# EAGLE design teletype-180824-no-slots (EAGLE 9.1.0)
COMPANY: monome

## Sheet 1 of 2
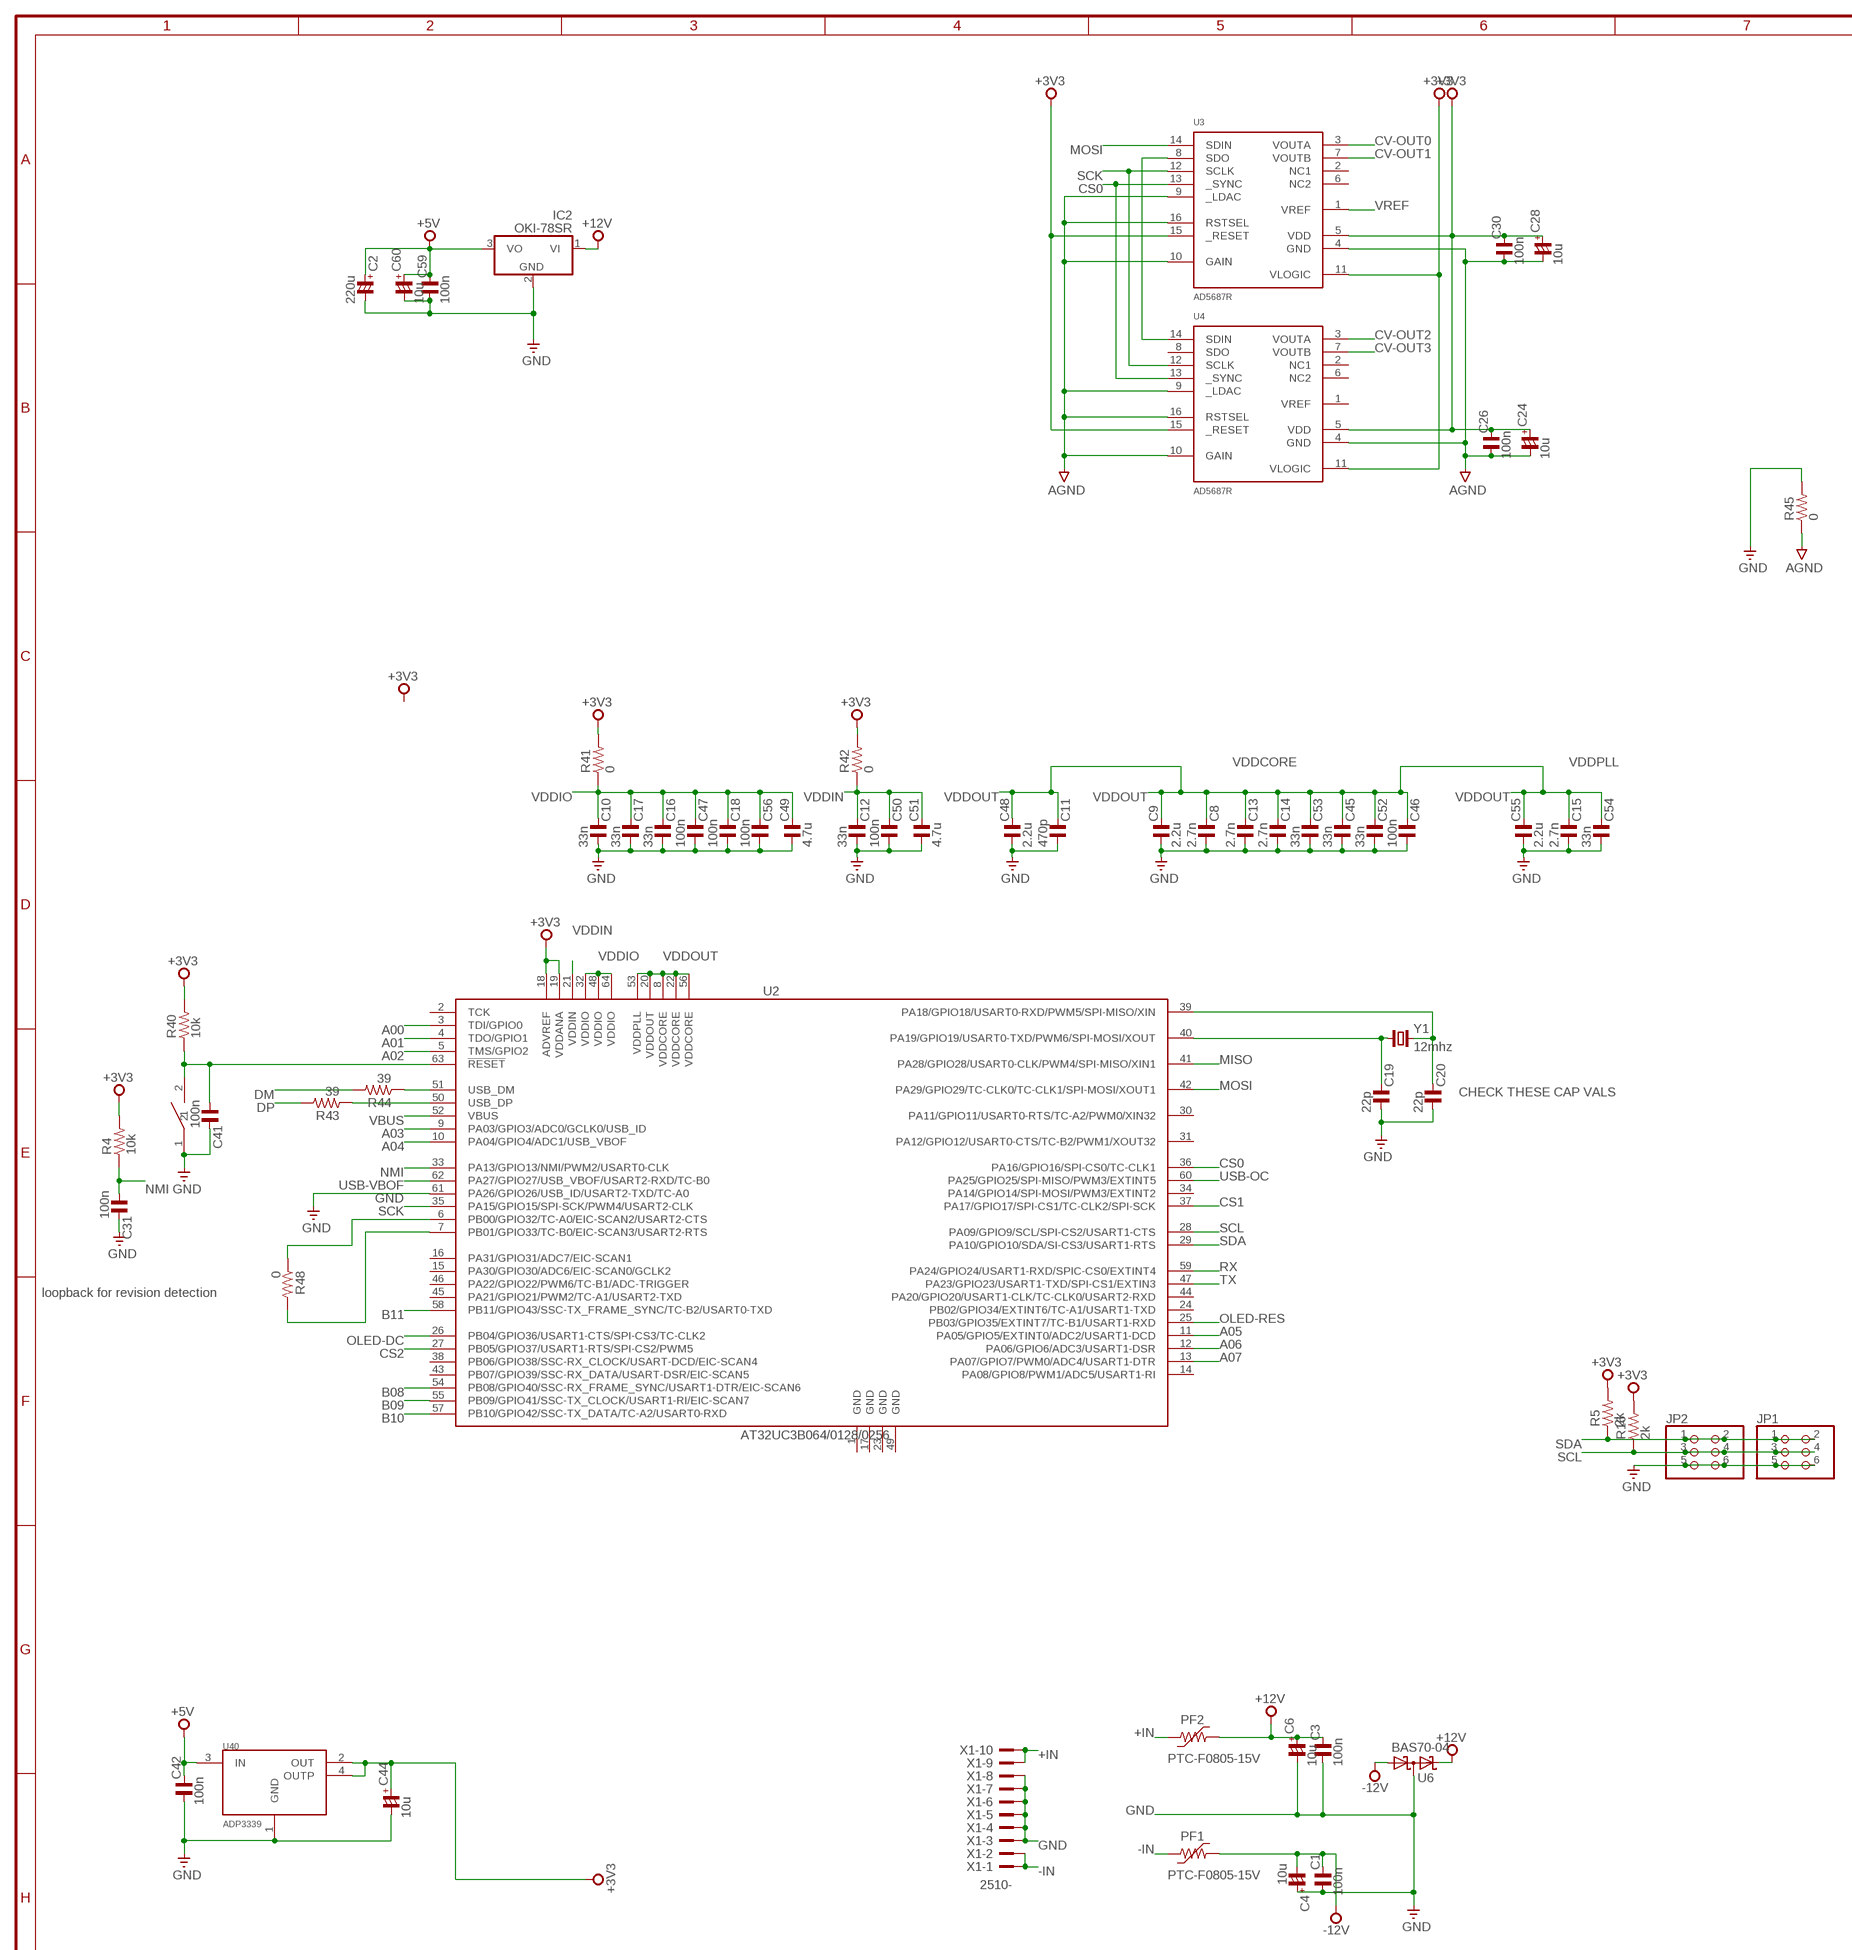
[diagram p0: schematic, sheet 1, part 1 of 2]
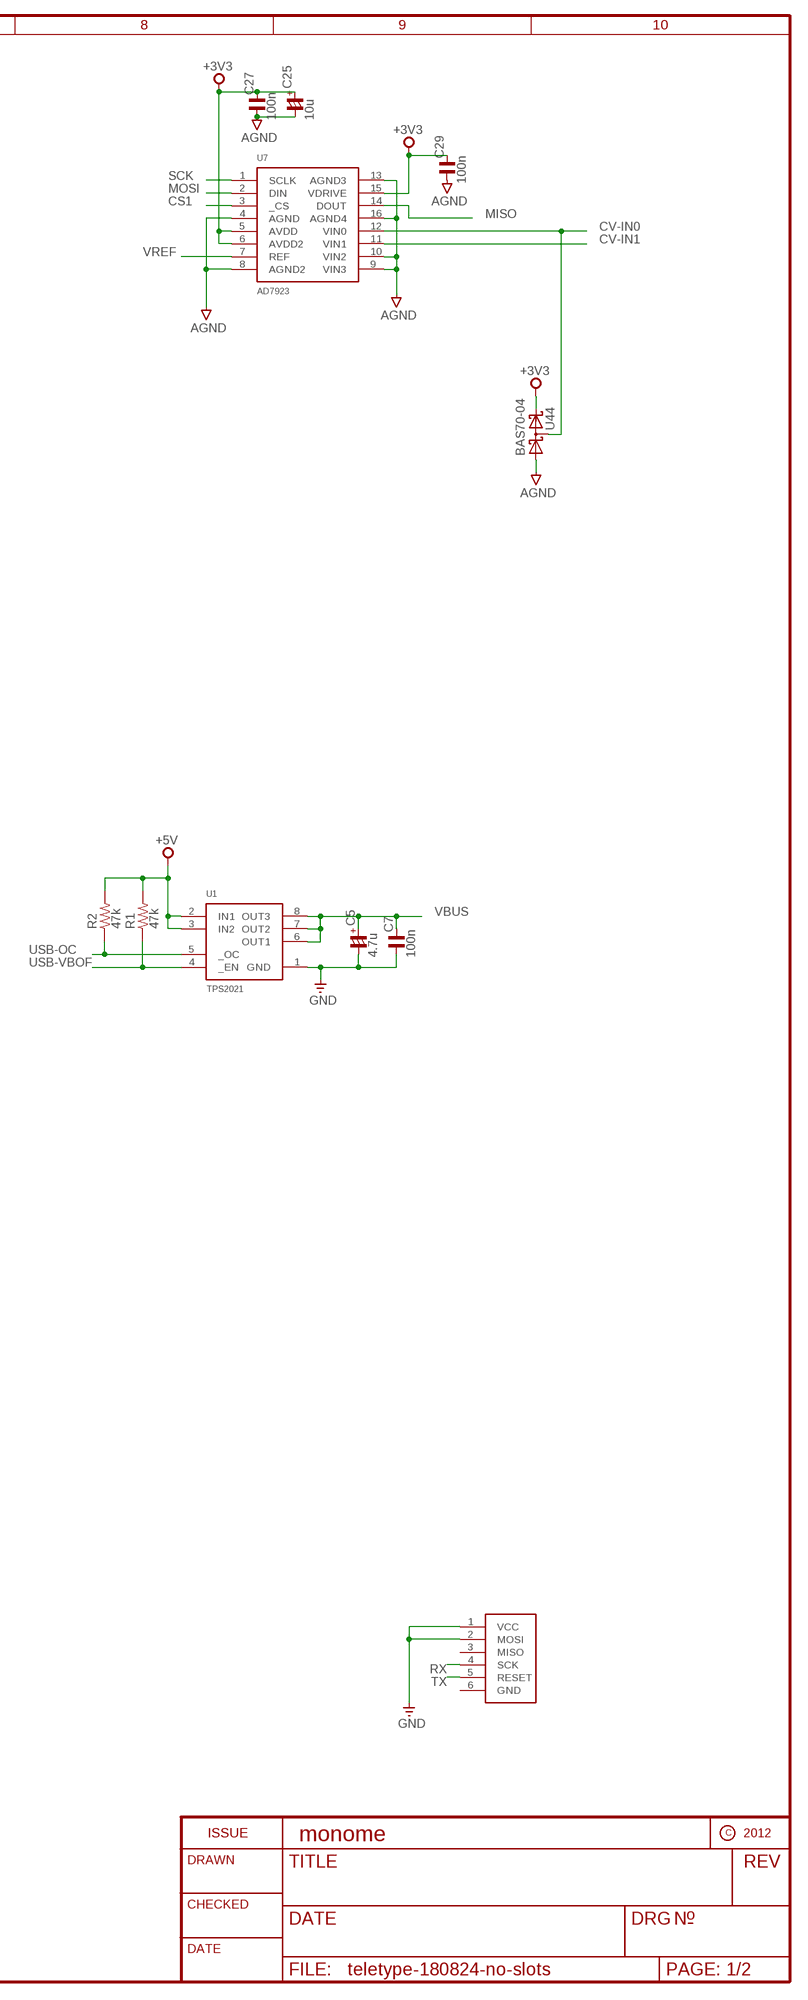
[diagram p1: schematic, sheet 1, part 2 of 2]

### Parts
C1  100n  C_0402  [C0402]
C2  220u  CP_7343-43  [C7343-43]
C3  100n  C_0402  [C0402]
C4  10u  CP_1206/T  [C1206/T]
C5  4.7u  CP_1206/T  [C1206/T]
C6  10u  CP_1206/T  [C1206/T]
C7  100n  C_0402  [C0402]
C8  2.7n  C_0402  [C0402]
C9  2.2u  C_0603  [C0603]
C10  33n  C_0402  [C0402]
C11  470p  C_0402  [C0402]
C12  33n  C_0402  [C0402]
C13  2.7n  C_0402  [C0402]
C14  2.7n  C_0402  [C0402]
C15  2.7n  C_0402  [C0402]
C16  33n  C_0402  [C0402]
C17  33n  C_0402  [C0402]
C18  100n  C_0402  [C0402]
C19  22p  C_0402  [C0402]
C20  22p  C_0402  [C0402]
C24  10u  CP_1206/T  [C1206/T]
C25  10u  CP_1206/T  [C1206/T]
C26  100n  C_0402  [C0402]
C27  100n  C_0402  [C0402]
C28  10u  CP_1206/T  [C1206/T]
C29  100n  C_0402  [C0402]
C30  100n  C_0402  [C0402]
C31  100n  C_0402  [C0402]
C41  100n  C_0402  [C0402]
C42  100n  C_0402  [C0402]
C44  10u  CP_1206/T  [C1206/T]
C45  33n  C_0402  [C0402]
C46  100n  C_0402  [C0402]
C47  100n  C_0402  [C0402]
C48  2.2u  C_0603  [C0603]
C49  4.7u  C_0603  [C0603]
C50  100n  C_0402  [C0402]
C51  4.7u  C_0603  [C0603]
C52  33n  C_0402  [C0402]
C53  33n  C_0402  [C0402]
C54  33n  C_0402  [C0402]
C55  2.2u  C_0603  [C0603]
C56  100n  C_0402  [C0402]
C59  100n  C_0402  [C0402]
C60  10u  CP_1206/T  [C1206/T]
IC2  OKI-78SR  7824TV  [TO220V]
J40  ISP-ROW  [ISP-ROW]
JP1  PINHD-2X3  [2X03]
JP2  PINHD-2X3  [2X03]
PF1  PTC-F0805-15V  PTC-F1206  [F1206]
PF2  PTC-F0805-15V  PTC-F1206  [F1206]
R1  47k  R_0402  [R0402]
R2  47k  R_0402  [R0402]
R4  10k  R_0402  [R0402]
R5  2k  R_0402  [R0402]
R16  2k  R_0402  [R0402]
R40  10k  R_0402  [R0402]
R41  0  R_0402  [R0402]
R42  0  R_0402  [R0402]
R43  39  R_0402  [R0402]
R44  39  R_0402  [R0402]
R45  0  R_0603  [R0603]
R48  0  R_0402  [R0402]
SW40  PANASONIC-EVQ  [PANASONIC-EVQ]
U1  TPS2021  TPS2020  [SO08]
U2  AT32UC3B064/0128/0256  [TQFP64-10X10]
U3  AD5687R  AD5689R  [TSSOP16]
U4  AD5687R  AD5689R  [TSSOP16]
U6  BAS70-04  [SOT23]
U7  AD7923  [TSSOP16]
U40  ADP3339  [SOT223]
U44  BAS70-04  [SOT23]
X1  2510-  [PAK100/2500-10]
Y1  12mhz  CRYTALHC49UP  [HC49UP]

### Nets
+3V3: C24.+ C25.+ C26.2 C27.2 C28.+ C29.2 C30.2 C44.+ R4.2 R5.2 R16.2 R40.2 R41.2 R42.2 U2.18(ADVREF) U2.19(VDDANA) U3.5(VDD) U3.11(VLOGIC) U3.15(_RESET) U4.5(VDD) U4.11(VLOGIC) U4.15(_RESET) U7.5(AVDD) U7.6(AVDD2) U7.15(VDRIVE) U40.2(OUT) U40.4(OUTP) U44.2(C2) ; also sheet 2
+5V: C2.+ C42.2 C59.2 C60.+ IC2.3(VO) R1.2 R2.2 U1.2(IN1) U1.3(IN2) U40.3(IN)
+12V: C3.2 C6.+ IC2.1(VI) PF2.2 U6.2(C2) ; also sheet 2
+IN: PF2.1 X1.9 X1.10
-12V: C1.2 C4.- PF1.2 U6.1(A1) ; also sheet 2
-IN: PF1.1 X1.1 X1.2
A00: U2.3(TDI/GPIO0) ; also sheet 2
A01: U2.4(TDO/GPIO1) ; also sheet 2
A02: U2.5(TMS/GPIO2) ; also sheet 2
A03: U2.9(PA03/GPIO3/ADC0/GCLK0/USB_ID) ; also sheet 2
A04: U2.10(PA04/GPIO4/ADC1/USB_VBOF) ; also sheet 2
A05: U2.11(PA05/GPIO5/EXTINT0/ADC2/USART1-DCD) ; also sheet 2
A06: U2.12(PA06/GPIO6/ADC3/USART1-DSR) ; also sheet 2
A07: U2.13(PA07/GPIO7/PWM0/ADC4/USART1-DTR) ; also sheet 2
AGND: C24.- C25.- C26.1 C27.1 C28.- C29.1 C30.1 R45.1 U3.4(GND) U3.9(_LDAC) U3.10(GAIN) U3.16(RSTSEL) U4.4(GND) U4.9(_LDAC) U4.10(GAIN) U4.16(RSTSEL) U7.4(AGND) U7.8(AGND2) U7.9(VIN3) U7.10(VIN2) U7.13(AGND3) U7.16(AGND4) U44.1(A1) ; also sheet 2
B08: U2.54(PB08/GPIO40/SSC-RX_FRAME_SYNC/USART1-DTR/EIC-SCAN6) ; also sheet 2
B09: U2.55(PB09/GPIO41/SSC-TX_CLOCK/USART1-RI/EIC-SCAN7) ; also sheet 2
B10: U2.57(PB10/GPIO42/SSC-TX_DATA/TC-A2/USART0-RXD) ; also sheet 2
B11: U2.58(PB11/GPIO43/SSC-TX_FRAME_SYNC/TC-B2/USART0-TXD) ; also sheet 2
CS0: U2.36(PA16/GPIO16/SPI-CS0/TC-CLK1) U3.13(_SYNC) U4.13(_SYNC)
CS1: U2.37(PA17/GPIO17/SPI-CS1/TC-CLK2/SPI-SCK) U7.3(_CS)
CS2: U2.27(PB05/GPIO37/USART1-RTS/SPI-CS2/PWM5) ; also sheet 2
CV-IN0: U7.12(VIN0) U44.3(C1A2) ; also sheet 2
CV-IN1: U7.11(VIN1) ; also sheet 2
CV-OUT0: U3.3(VOUTA) ; also sheet 2
CV-OUT1: U3.7(VOUTB) ; also sheet 2
CV-OUT2: U4.3(VOUTA) ; also sheet 2
CV-OUT3: U4.7(VOUTB) ; also sheet 2
DM: R44.2 ; also sheet 2
DP: R43.2 ; also sheet 2
GND: C1.1 C2.- C3.1 C4.+ C5.- C6.- C7.1 C8.1 C9.1 C10.1 C11.1 C12.1 C13.1 C14.1 C15.1 C16.1 C17.1 C18.1 C19.1 C20.1 C31.2 C41.2 C42.1 C44.- C45.1 C46.1 C47.1 C48.1 C49.1 C50.1 C51.1 C52.1 C53.1 C54.1 C55.1 C56.1 C59.1 C60.- IC2.2(GND) J40.1(VCC) J40.2(MOSI) JP1.5 JP1.6 JP2.5 JP2.6 R45.2 SW40.1 U1.1(GND) U2.61(PA26/GPIO26/USB_ID/USART2-TXD/TC-A0) U6.3(C1A2) U40.1(GND) X1.3 X1.4 X1.5 X1.6 X1.7 X1.8 ; also sheet 2
MISO: U2.41(PA28/GPIO28/USART0-CLK/PWM4/SPI-MISO/XIN1) U7.14(DOUT)
MOSI: U2.42(PA29/GPIO29/TC-CLK0/TC-CLK1/SPI-MOSI/XOUT1) U3.14(SDIN) U7.2(DIN) ; also sheet 2
N$1: R44.1 U2.51(USB_DM)
N$2: R43.1 U2.50(USB_DP)
N$4: U3.8(SDO) U4.14(SDIN)
N$14: C20.2 U2.39(PA18/GPIO18/USART0-RXD/PWM5/SPI-MISO/XIN) Y1.2
N$17: R48.1 U2.6(PB00/GPIO32/TC-A0/EIC-SCAN2/USART2-CTS)
N$18: R48.2 U2.7(PB01/GPIO33/TC-B0/EIC-SCAN3/USART2-RTS)
N$109: C19.2 U2.40(PA19/GPIO19/USART0-TXD/PWM6/SPI-MOSI/XOUT) Y1.1
NMI: C31.1 R4.1 U2.33(PA13/GPIO13/NMI/PWM2/USART0-CLK) ; also sheet 2
OLED-DC: U2.26(PB04/GPIO36/USART1-CTS/SPI-CS3/TC-CLK2) ; also sheet 2
OLED-RES: U2.25(PB03/GPIO35/EXTINT7/TC-B1/USART1-RXD) ; also sheet 2
RESET: C41.1 R40.1 SW40.2 U2.63(!RESET)
RX: J40.4(SCK) U2.59(PA24/GPIO24/USART1-RXD/SPIC-CS0/EXTINT4)
SCK: U2.35(PA15/GPIO15/SPI-SCK/PWM4/USART2-CLK) U3.12(SCLK) U4.12(SCLK) U7.1(SCLK) ; also sheet 2
SCL: JP1.3 JP1.4 JP2.3 JP2.4 R16.1 U2.28(PA09/GPIO9/SCL/SPI-CS2/USART1-CTS)
SDA: JP1.1 JP1.2 JP2.1 JP2.2 R5.1 U2.29(PA10/GPIO10/SDA/SI-CS3/USART1-RTS)
TX: J40.5(RESET) U2.47(PA23/GPIO23/USART1-TXD/SPI-CS1/EXTIN3)
USB-OC: R2.1 U1.5(_OC) U2.60(PA25/GPIO25/SPI-MISO/PWM3/EXTINT5)
USB-VBOF: R1.1 U1.4(_EN) U2.62(PA27/GPIO27/USB_VBOF/USART2-RXD/TC-B0)
VBUS: C5.+ C7.2 U1.6(OUT1) U1.7(OUT2) U1.8(OUT3) U2.52(VBUS) ; also sheet 2
VDDIN: C12.2 C50.2 C51.2 R42.1 U2.21(VDDIN)
VDDIO: C10.2 C16.2 C17.2 C18.2 C47.2 C49.2 C56.2 R41.1 U2.32(VDDIO) U2.48(VDDIO) U2.64(VDDIO)
VDDOUT: C8.2 C9.2 C11.2 C13.2 C14.2 C15.2 C45.2 C46.2 C48.2 C52.2 C53.2 C54.2 C55.2 U2.8(VDDCORE) U2.20(VDDOUT) U2.22(VDDCORE) U2.53(VDDPLL) U2.56(VDDCORE)
VREF: U3.1(VREF) U7.7(REF)
Unconnected: J40.3(MISO) J40.6(GND) U2.2(TCK) U2.14(PA08/GPIO8/PWM1/ADC5/USART1-RI) U2.15(PA30/GPIO30/ADC6/EIC-SCAN0/GCLK2) U2.16(PA31/GPIO31/ADC7/EIC-SCAN1) U2.24(PB02/GPIO34/EXTINT6/TC-A1/USART1-TXD) U2.30(PA11/GPIO11/USART0-RTS/TC-A2/PWM0/XIN32) U2.31(PA12/GPIO12/USART0-CTS/TC-B2/PWM1/XOUT32) U2.34(PA14/GPIO14/SPI-MOSI/PWM3/EXTINT2) U2.38(PB06/GPIO38/SSC-RX_CLOCK/USART-DCD/EIC-SCAN4) U2.43(PB07/GPIO39/SSC-RX_DATA/USART-DSR/EIC-SCAN5) U2.44(PA20/GPIO20/USART1-CLK/TC-CLK0/USART2-RXD) U2.45(PA21/GPIO21/PWM2/TC-A1/USART2-TXD) U2.46(PA22/GPIO22/PWM6/TC-B1/ADC-TRIGGER) U3.2(NC1) U3.6(NC2) U4.1(VREF) U4.2(NC1) U4.6(NC2) U4.8(SDO)

### Notes on the sheet
- VDDCORE | VDDPLL
- CHECK THESE CAP VALS
- loopback for revision detection

## Sheet 2 of 2
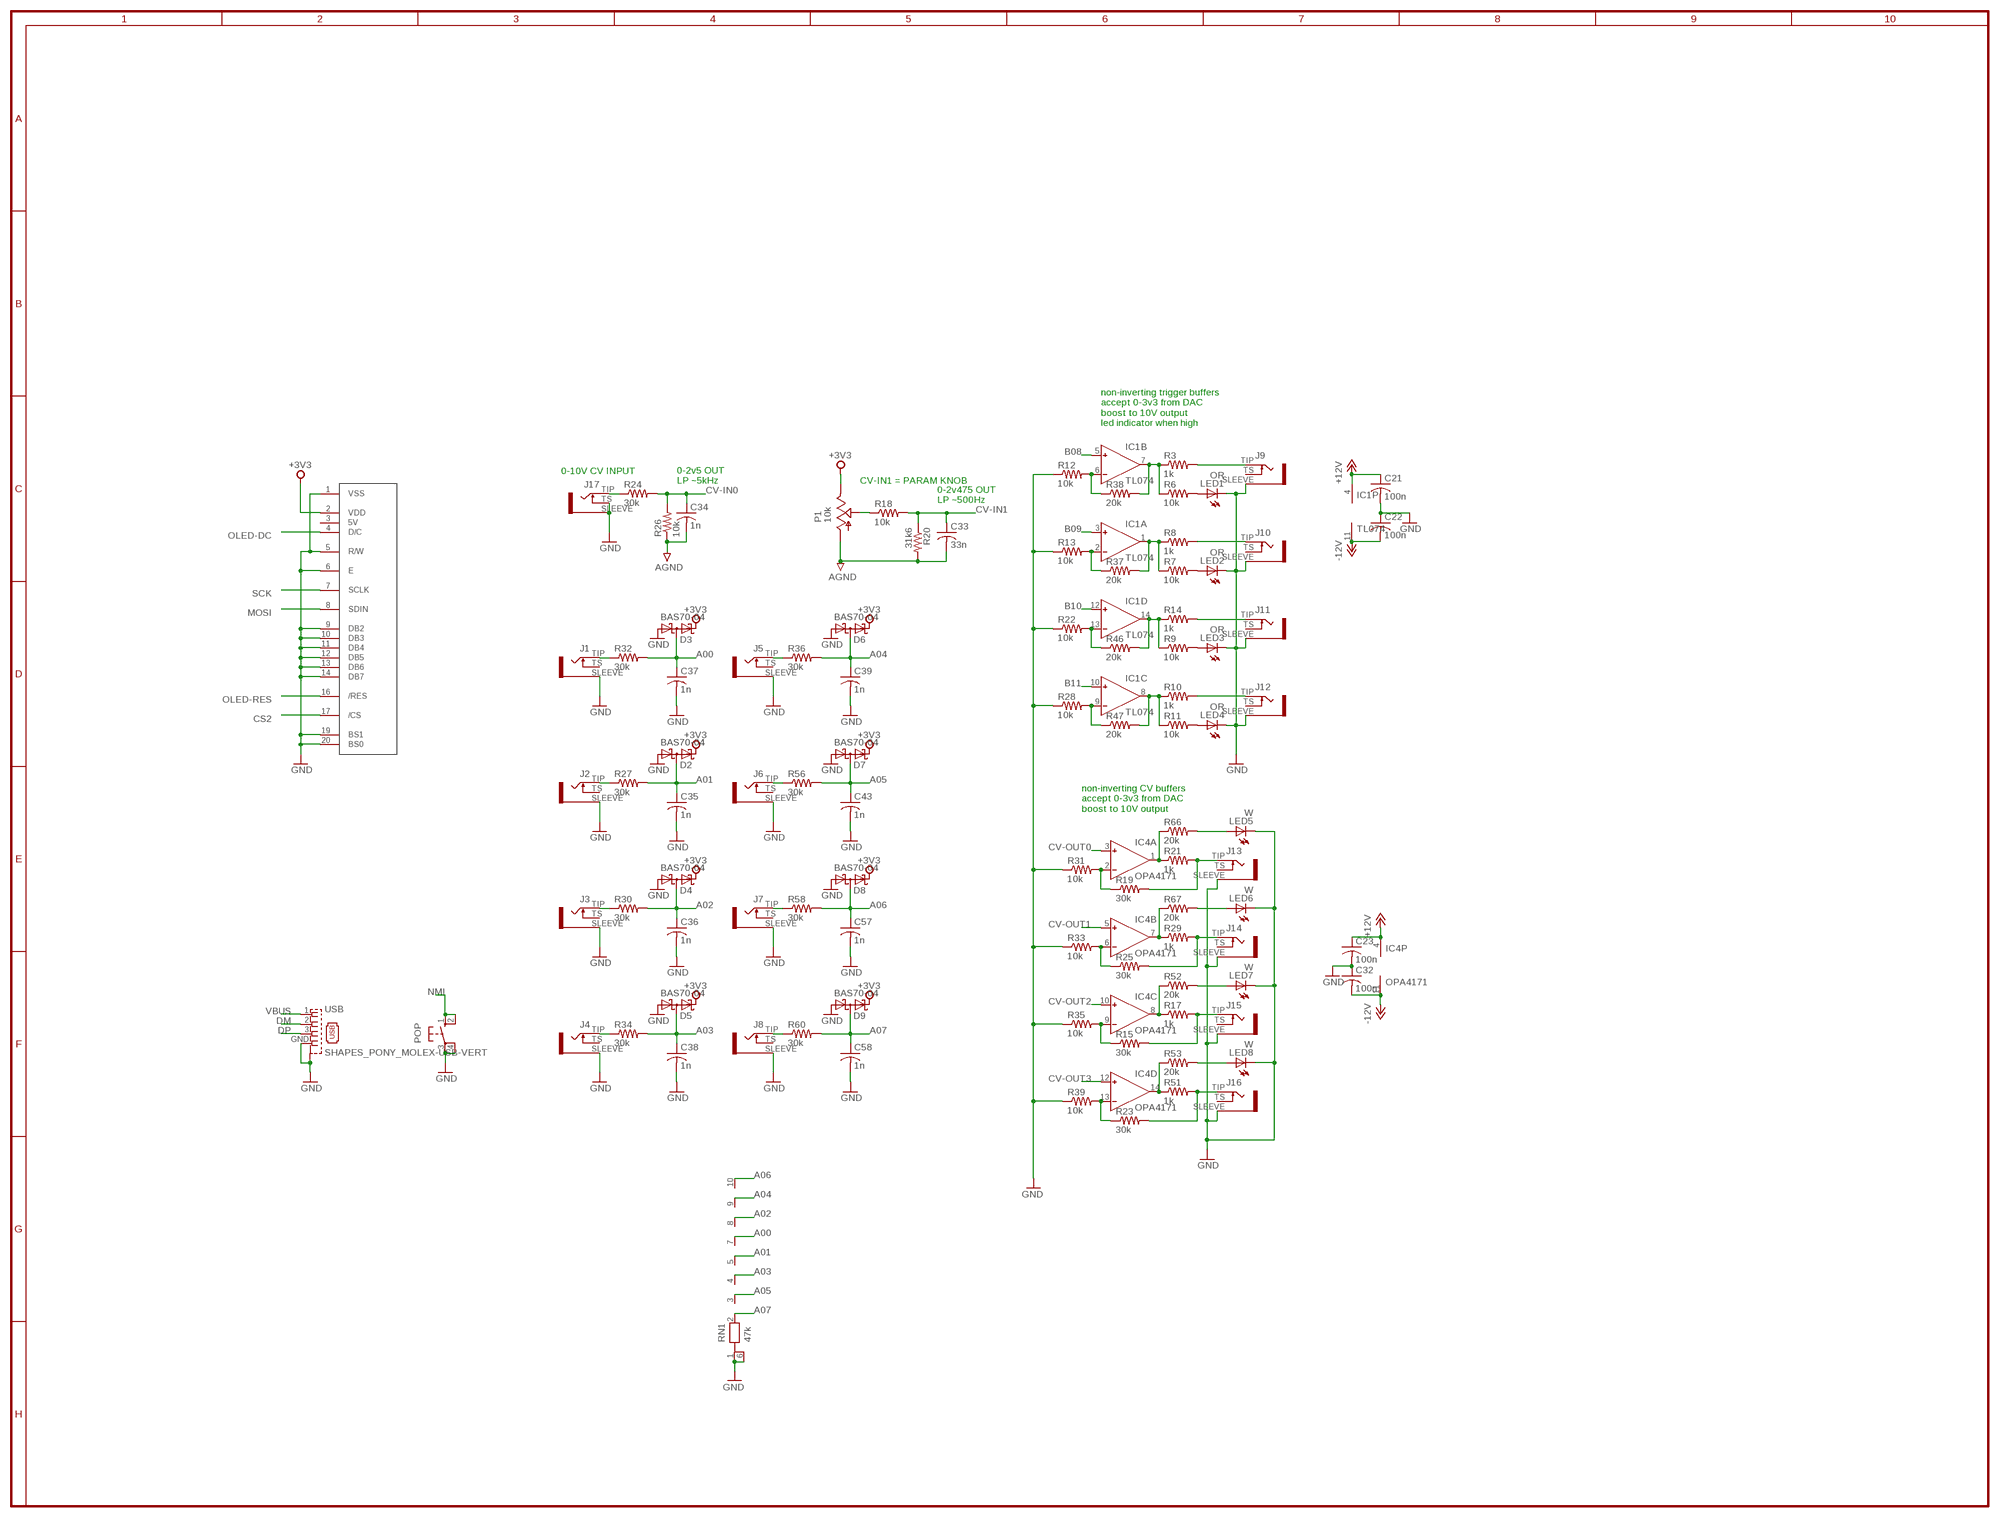
[diagram p2: schematic, sheet 2]

### Parts
C21  100n  C-USC0402  [C0402]
C22  100n  C-USC0402  [C0402]
C23  100n  C-USC0402  [C0402]
C32  100n  C-USC0402  [C0402]
C33  33n  C-USC0402  [C0402]
C34  1n  C-USC0402  [C0402]
C35  1n  C-USC0402  [C0402]
C36  1n  C-USC0402  [C0402]
C37  1n  C-USC0402  [C0402]
C38  1n  C-USC0402  [C0402]
C39  1n  C-USC0402  [C0402]
C43  1n  C-USC0402  [C0402]
C57  1n  C-USC0402  [C0402]
C58  1n  C-USC0402  [C0402]
D2  BAS70-04  [SOT23]
D3  BAS70-04  [SOT23]
D4  BAS70-04  [SOT23]
D5  BAS70-04  [SOT23]
D6  BAS70-04  [SOT23]
D7  BAS70-04  [SOT23]
D8  BAS70-04  [SOT23]
D9  BAS70-04  [SOT23]
IC1  TL074  AD8644R  [SO14]
IC4  OPA4171  AD8644R  [SO14]
J1  WQP-PJ301M-12_JACK  [WQP-PJ301M-12_JACK]
J2  WQP-PJ301M-12_JACK  [WQP-PJ301M-12_JACK]
J3  WQP-PJ301M-12_JACK  [WQP-PJ301M-12_JACK]
J4  WQP-PJ301M-12_JACK  [WQP-PJ301M-12_JACK]
J5  WQP-PJ301M-12_JACK  [WQP-PJ301M-12_JACK]
J6  WQP-PJ301M-12_JACK  [WQP-PJ301M-12_JACK]
J7  WQP-PJ301M-12_JACK  [WQP-PJ301M-12_JACK]
J8  WQP-PJ301M-12_JACK  [WQP-PJ301M-12_JACK]
J9  WQP-PJ301M-12_JACK  [WQP-PJ301M-12_JACK]
J10  WQP-PJ301M-12_JACK  [WQP-PJ301M-12_JACK]
J11  WQP-PJ301M-12_JACK  [WQP-PJ301M-12_JACK]
J12  WQP-PJ301M-12_JACK  [WQP-PJ301M-12_JACK]
J13  WQP-PJ301M-12_JACK  [WQP-PJ301M-12_JACK]
J14  WQP-PJ301M-12_JACK  [WQP-PJ301M-12_JACK]
J15  WQP-PJ301M-12_JACK  [WQP-PJ301M-12_JACK]
J16  WQP-PJ301M-12_JACK  [WQP-PJ301M-12_JACK]
J17  WQP-PJ301M-12_JACK  [WQP-PJ301M-12_JACK]
LED1  OR  LEDCHIP-LED0805  [CHIP-LED0805]
LED2  OR  LEDCHIP-LED0805  [CHIP-LED0805]
LED3  OR  LEDCHIP-LED0805  [CHIP-LED0805]
LED4  OR  LEDCHIP-LED0805  [CHIP-LED0805]
LED5  W  LEDCHIP-LED0805  [CHIP-LED0805]
LED6  W  LEDCHIP-LED0805  [CHIP-LED0805]
LED7  W  LEDCHIP-LED0805  [CHIP-LED0805]
LED8  W  LEDCHIP-LED0805  [CHIP-LED0805]
P1  10k  POT_USVERTICAL  [ALPS_POT_VERTICAL]
POP  SWITCH-OMRON_10-XX  [SWITCH-OMRON_B3F-10XX]
R3  1k  R-US_R0402  [R0402]
R6  10k  R-US_R0402  [R0402]
R7  10k  R-US_R0402  [R0402]
R8  1k  R-US_R0402  [R0402]
R9  10k  R-US_R0402  [R0402]
R10  1k  R-US_R0402  [R0402]
R11  10k  R-US_R0402  [R0402]
R12  10k  R-US_R0402  [R0402]
R13  10k  R-US_R0402  [R0402]
R14  1k  R-US_R0402  [R0402]
R15  30k  R-US_R0402  [R0402]
R17  1k  R-US_R0402  [R0402]
R18  10k  R-US_R0402  [R0402]
R19  30k  R-US_R0402  [R0402]
R20  31k6  R-US_R0402  [R0402]
R21  1k  R-US_R0402  [R0402]
R22  10k  R-US_R0402  [R0402]
R23  30k  R-US_R0402  [R0402]
R24  30k  R-US_R0402  [R0402]
R25  30k  R-US_R0402  [R0402]
R26  10k  R-US_R0402  [R0402]
R27  30k  R-US_R0402  [R0402]
R28  10k  R-US_R0402  [R0402]
R29  1k  R-US_R0402  [R0402]
R30  30k  R-US_R0402  [R0402]
R31  10k  R-US_R0402  [R0402]
R32  30k  R-US_R0402  [R0402]
R33  10k  R-US_R0402  [R0402]
R34  30k  R-US_R0402  [R0402]
R35  10k  R-US_R0402  [R0402]
R36  30k  R-US_R0402  [R0402]
R37  20k  R-US_R0402  [R0402]
R38  20k  R-US_R0402  [R0402]
R39  10k  R-US_R0402  [R0402]
R46  20k  R-US_R0402  [R0402]
R47  20k  R-US_R0402  [R0402]
R51  1k  R-US_R0402  [R0402]
R52  20k  R-US_R0402  [R0402]
R53  20k  R-US_R0402  [R0402]
R56  30k  R-US_R0402  [R0402]
R58  30k  R-US_R0402  [R0402]
R60  30k  R-US_R0402  [R0402]
R66  20k  R-US_R0402  [R0402]
R67  20k  R-US_R0402  [R0402]
RN1  47k  RESNET08  [MNR35]
U$1  OLED128X64  [OLED-ALEPH]
USB  SHAPES_PONY_MOLEX-USB-VERT  [SHAPES_PONY_MOLEX-USB]

### Nets
+3V3: D2.2(C2) D3.2(C2) D4.2(C2) D5.2(C2) D6.2(C2) D7.2(C2) D8.2(C2) D9.2(C2) P1.P$1(E) U$1.2(VDD) ; also sheet 1
+12V: C21.1 C23.1 IC1.4(P:V+) IC4.4(P:V+) ; also sheet 1
-12V: C22.2 C32.2 IC1.11(P:V-) IC4.11(P:V-) ; also sheet 1
A00: C37.1 D3.3(C1A2) R32.2 RN1.7 ; also sheet 1
A01: C35.1 D2.3(C1A2) R27.2 RN1.5 ; also sheet 1
A02: C36.1 D4.3(C1A2) R30.2 RN1.8 ; also sheet 1
A03: C38.1 D5.3(C1A2) R34.2 RN1.4 ; also sheet 1
A04: C39.1 D6.3(C1A2) R36.2 RN1.9 ; also sheet 1
A05: C43.1 D7.3(C1A2) R56.2 RN1.3 ; also sheet 1
A06: C57.1 D8.3(C1A2) R58.2 RN1.10 ; also sheet 1
A07: C58.1 D9.3(C1A2) R60.2 RN1.2 ; also sheet 1
AGND: C33.2 C34.2 P1.P$3(A) R20.2 R26.1 ; also sheet 1
B08: IC1.5(B:IN+) ; also sheet 1
B09: IC1.3(A:IN+) ; also sheet 1
B10: IC1.12(D:IN+) ; also sheet 1
B11: IC1.10(C:IN+) ; also sheet 1
CS2: U$1.17(/CS) ; also sheet 1
CV-IN0: C34.1 R24.2 R26.2 ; also sheet 1
CV-IN1: C33.1 R18.2 R20.1 ; also sheet 1
CV-OUT0: IC4.3(A:IN+) ; also sheet 1
CV-OUT1: IC4.5(B:IN+) ; also sheet 1
CV-OUT2: IC4.10(C:IN+) ; also sheet 1
CV-OUT3: IC4.12(D:IN+) ; also sheet 1
DM: USB.2 ; also sheet 1
DP: USB.3 ; also sheet 1
GND: C21.2 C22.1 C23.2 C32.1 C35.2 C36.2 C37.2 C38.2 C39.2 C43.2 C57.2 C58.2 D2.1(A1) D3.1(A1) D4.1(A1) D5.1(A1) D6.1(A1) D7.1(A1) D8.1(A1) D9.1(A1) J1.SLEEVE J2.SLEEVE J3.SLEEVE J4.SLEEVE J5.SLEEVE J6.SLEEVE J7.SLEEVE J8.SLEEVE J9.SLEEVE J10.SLEEVE J11.SLEEVE J12.SLEEVE J13.SLEEVE J14.SLEEVE J15.SLEEVE J16.SLEEVE J17.SLEEVE J17.TS LED1.C LED2.C LED3.C LED4.C LED5.C LED6.C LED7.C LED8.C POP.3(P) POP.4(P1) R12.1 R13.1 R22.1 R28.1 R31.1 R33.1 R35.1 R39.1 RN1.1 RN1.6 U$1.1(VSS) U$1.5(R/W) U$1.6(E) U$1.9(DB2) U$1.10(DB3) U$1.11(DB4) U$1.12(DB5) U$1.13(DB6) U$1.14(DB7) U$1.19(BS1) U$1.20(BS0) USB.GND USB.M1(S1) USB.M2(S1) USB.M4(S1) ; also sheet 1
MOSI: U$1.8(SDIN) ; also sheet 1
N$3: IC1.7(B:OUT) R3.1 R6.1 R38.2
N$5: IC1.1(A:OUT) R7.1 R8.1 R37.2
N$6: IC1.14(D:OUT) R9.1 R14.1 R46.2
N$7: IC1.8(C:OUT) R10.1 R11.1 R47.2
N$8: J9.TIP R3.2
N$9: J10.TIP R8.2
N$10: J11.TIP R14.2
N$11: J12.TIP R10.2
N$12: P1.P$2(S) R18.1
N$13: IC4.1(A:OUT) R21.1 R66.1
N$15: IC4.7(B:OUT) R29.1 R67.1
N$16: LED5.A R66.2
N$21: J15.TIP R15.2 R17.2
N$22: J16.TIP R23.2 R51.2
N$23: IC4.8(C:OUT) R17.1 R52.1
N$24: LED6.A R67.2
N$28: IC4.14(D:OUT) R51.1 R53.1
N$29: LED7.A R52.2
N$30: LED8.A R53.2
N$32: J13.TIP R19.2 R21.2
N$33: J17.TIP R24.1
N$34: J14.TIP R25.2 R29.2
N$35: J2.TIP R27.1
N$36: J3.TIP R30.1
N$37: J4.TIP R34.1
N$38: J1.TIP R32.1
N$39: J5.TIP R36.1
N$40: J6.TIP R56.1
N$43: J7.TIP R58.1
N$44: J8.TIP R60.1
N$67: LED1.A R6.2
N$68: LED2.A R7.2
N$70: LED3.A R9.2
N$71: LED4.A R11.2
NMI: POP.1(S) POP.2(S1) ; also sheet 1
OLED-DC: U$1.4(D/C) ; also sheet 1
OLED-RES: U$1.16(/RES) ; also sheet 1
RG1: IC1.6(B:IN-) R12.2 R38.1
RG2: IC1.2(A:IN-) R13.2 R37.1
RG3: IC1.13(D:IN-) R22.2 R46.1
RG4: IC1.9(C:IN-) R28.2 R47.1
RG5: IC4.2(A:IN-) R19.1 R31.2
RG6: IC4.6(B:IN-) R25.1 R33.2
RG7: IC4.9(C:IN-) R15.1 R35.2
RG8: IC4.13(D:IN-) R23.1 R39.2
SCK: U$1.7(SCLK) ; also sheet 1
VBUS: USB.1 ; also sheet 1
Unconnected: J1.TS J2.TS J3.TS J4.TS J5.TS J6.TS J7.TS J8.TS J9.TS J10.TS J11.TS J12.TS J13.TS J14.TS J15.TS J16.TS U$1.3(5V)

### Notes on the sheet
- non-inverting trigger buffers
  accept 0-3v3 from DAC
  boost to 10V output
  led indicator when high
- 0-10V CV INPUT
- 0-2v5 OUT
  LP ~5kHz
- CV-IN1 = PARAM KNOB
- 0-2v475 OUT
  LP ~500Hz
- non-inverting CV buffers
  accept 0-3v3 from DAC
  boost to 10V output

## Power pins joined to a net without a drawn wire
GND: U2.1(GND) U2.17(GND) U2.23(GND) U2.49(GND)

## Library data of the parts
C1 C3 C7-C20 C26 C27 C29-C31 C41 C42 C45-C56 C59 = rc-master-smd:C_: NON-POLARIZED CAP
C2 C4-C6 C24 C25 C28 C44 C60 = rc-master-smd:CP_: POLARIZED CAP
C21-C23 C32-C39 C43 C57 C58 = rcl:C-US: CAPACITOR, American symbol
D2-D9 U6 U44 = diode:BAS70-04: Silicon Schottky Diodes General-purpose diode for high-speed switching
IC1 IC4 = analog-devices:AD8644: Single and Quad 18 V Operational Amplifiers Source: http://www.analog.com/static/imported-files/data_sheets/AD8614_8644.pdf; MF: ALTERA CORPORATION; MPN: AD8644ARZ; OC_FARNELL: 1438873; OC_NEWARK: 59K7037
IC2 = linear:78*: Positive VOLTAGE REGULATOR Source: http://cache.national.com/ds/LM/LM78L05.pdf http://www.fairchildsemi.com/ds/LM/LM7805.pdf
J1-J17 = thonkiconn:WQP-PJ301M-12_JACK
J40 = monome-inc:ISP-ROW
JP1 JP2 = pinhead:PINHD-2X3: PIN HEADER
LED1-LED8 = led:LED: LED OSRAM: - CHIPLED LG R971, LG N971, LY N971, LG Q971, LY Q971, LO R971, LY R971 LH N974, LH R974 LS Q976, LO Q976, LY Q976 LO Q996 - Hyper CHIPLED LW Q18S LB Q993, LB Q99A, LB R99A - SideLED LS A670, LO A670, LY A670, LG A670, LP A670 LB A673, LV A673, LT A673, LW A673 LH A674 LY A675 LS A676, LA A676, LO A676, LY A676, LW A676 LS A679, LY A679, LG A679 - Hyper Micro SIDELED® LS Y876, LA Y876, LO Y876, LY Y876 LT Y87S - SmartLED LW L88C, LW L88S LB L89C, LB L89S, LG L890 LS L89K, LO L89K, LY L89K LS L896, LA L896, LO L896, LY L896 - TOPLED LS T670, LO T670, LY T670, LG T670, LP T670 LSG T670, LSP T670, LSY T670, LOP T670, LYG T670 LG T671, LOG T671, LSG T671 LB T673, LV T673, LT T673, LW T673 LH T674 LS T676, LA T676, LO T676, LY T676, LB T676, LH T676, LSB T676, LW T676 LB T67C, LV T67C, LT T67C, LS T67K, LO T67K, LY T67K, LW E67C LS E67B, LA E67B, LO E67B, LY E67B, LB E67C, LV E67C, LT E67C LW T67C LS T679, LY T679, LG T679 LS T770, LO T770, LY T770, LG T770, LP T770 LB T773, LV T773, LT T773, LW T773 LH T774 LS E675, LA E675, LY E675, LS T675 LS T776, LA T776, LO T776, LY T776, LB T776 LHGB T686 LT T68C, LB T68C - Hyper Mini TOPLED® LB M676 - Mini TOPLED Santana® LG M470 LS M47K, LO M47K, LY M47K Source: http://www.osram.convergy.de LUXEON: - LUMILED® LXK2-PW12-R00, LXK2-PW12-S00, LXK2-PW14-U00, LXK2-PW14-V00 LXK2-PM12-R00, LXK2-PM12-S00, LXK2-PM14-U00 LXK2-PE12-Q00, LXK2-PE12-R00, LXK2-PE12-S00, LXK2-PE14-T00, LXK2-PE14-U00 LXK2-PB12-K00, LXK2-PB12-L00, LXK2-PB12-M00, LXK2-PB14-N00, LXK2-PB14-P00, LXK2-PB14-Q00 LXK2-PR12-L00, LXK2-PR12-M00, LXK2-PR14-Q00, LXK2-PR14-R00 LXK2-PD12-Q00, LXK2-PD12-R00, LXK2-PD12-S00 LXK2-PH12-R00, LXK2-PH12-S00 LXK2-PL12-P00, LXK2-PL12-Q00, LXK2-PL12-R00 Source: www.luxeon.com KINGBRIGHT: KA-3528ASYC Source: www.kingbright.com
P1 = og-pots:POT_US
PF1 PF2 = polyswitch:PTC-: POLYSWITCH Polyswitch Resetable Fuses
POP = monome_modular:SWITCH-OMRON_10-XX: OMRON SWITCH; MPN: B3F-1000; OC_FARNELL: 176432; OC_NEWARK: 36M3542
R1 R2 R4 R5 R16 R40-R45 R48 = rc-master-smd:R_: RESISTOR
R3 R6-R15 R17-R39 R46 R47 R51-R53 R56 R58 R60 R66 R67 = rcl:R-US_: RESISTOR, American symbol
RN1 = field:RESNET08
SW40 = monome-inc:PANASONIC-EVQ
U1 = monome-inc:TPS2020
U2 = atmel-avr32-michel-rev1:AT32UC3B064/0128/0256: AT32UC3B0128/0256/0512
U3 U4 = monome-inc:AD5689R
U7 = monome-inc:AD7923: ADC quad 12 bit
U40 = monome-inc:ADP3339
U$1 = monome_modular:OLED128X64
USB = monome_modular:SHAPES_PONY_MOLEX-USB-VERT
X1 = con-3m:2510-: 3M (TM) Pak 100 4-Wall Header Source: 3M; MF: 3M; MPN: 2510-6002UB; OC_FARNELL: 9838244; OC_NEWARK: 46F4725
Y1 = crystal:CRYTAL: CRYSTAL

## Board
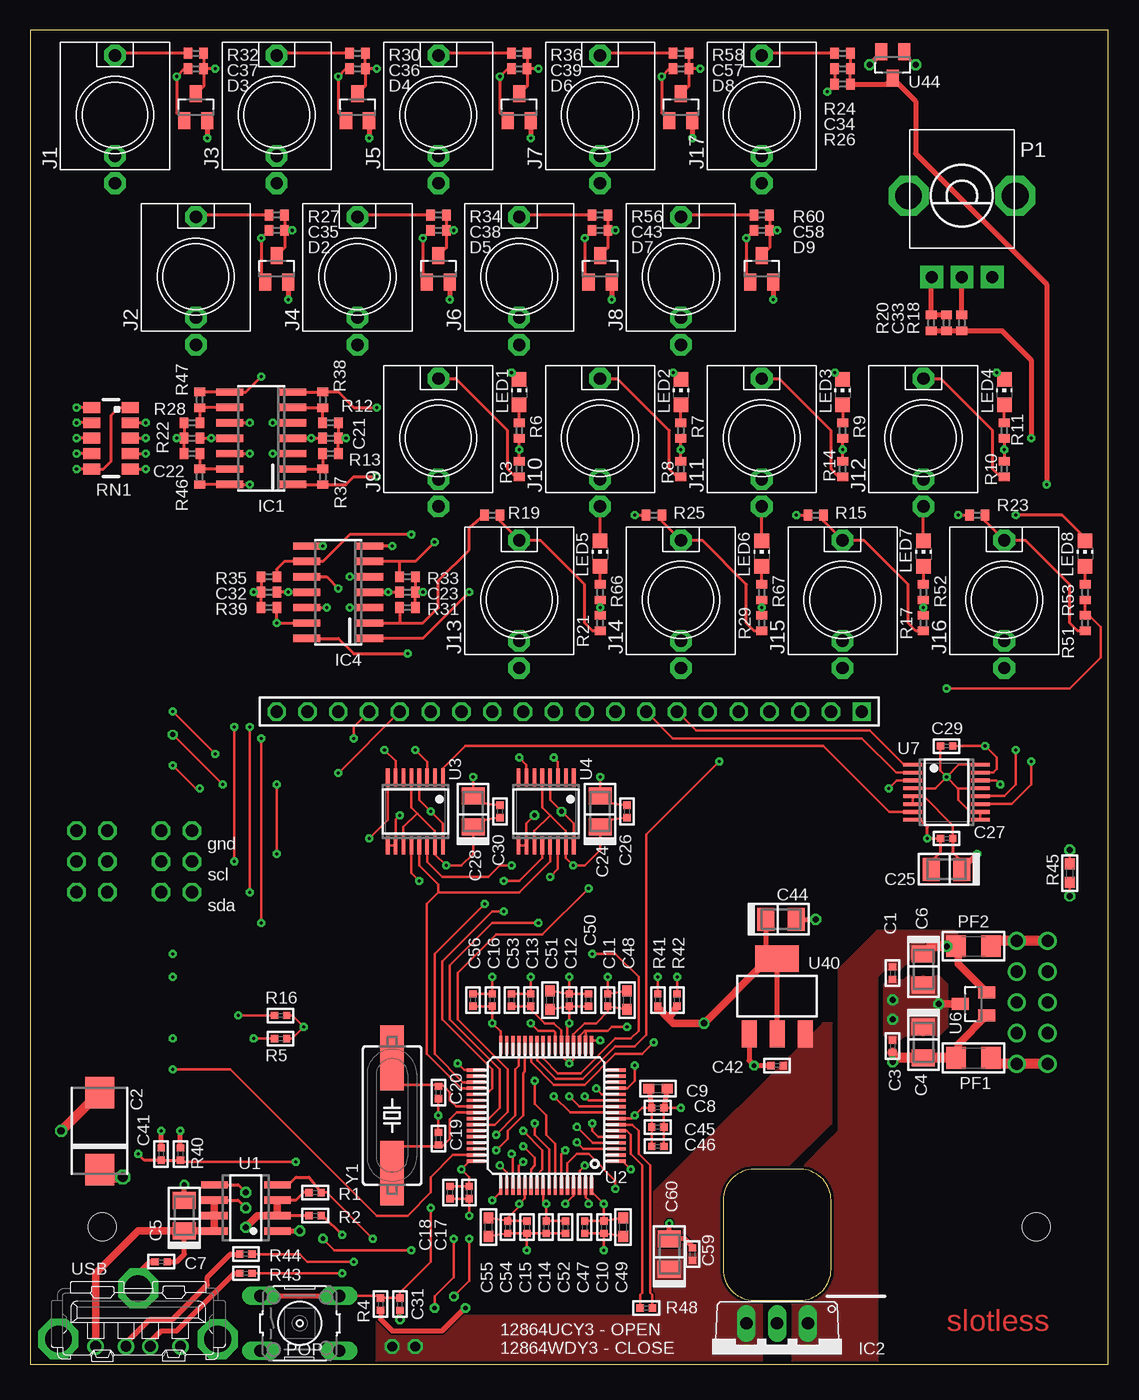
[diagram p3: board, top side]
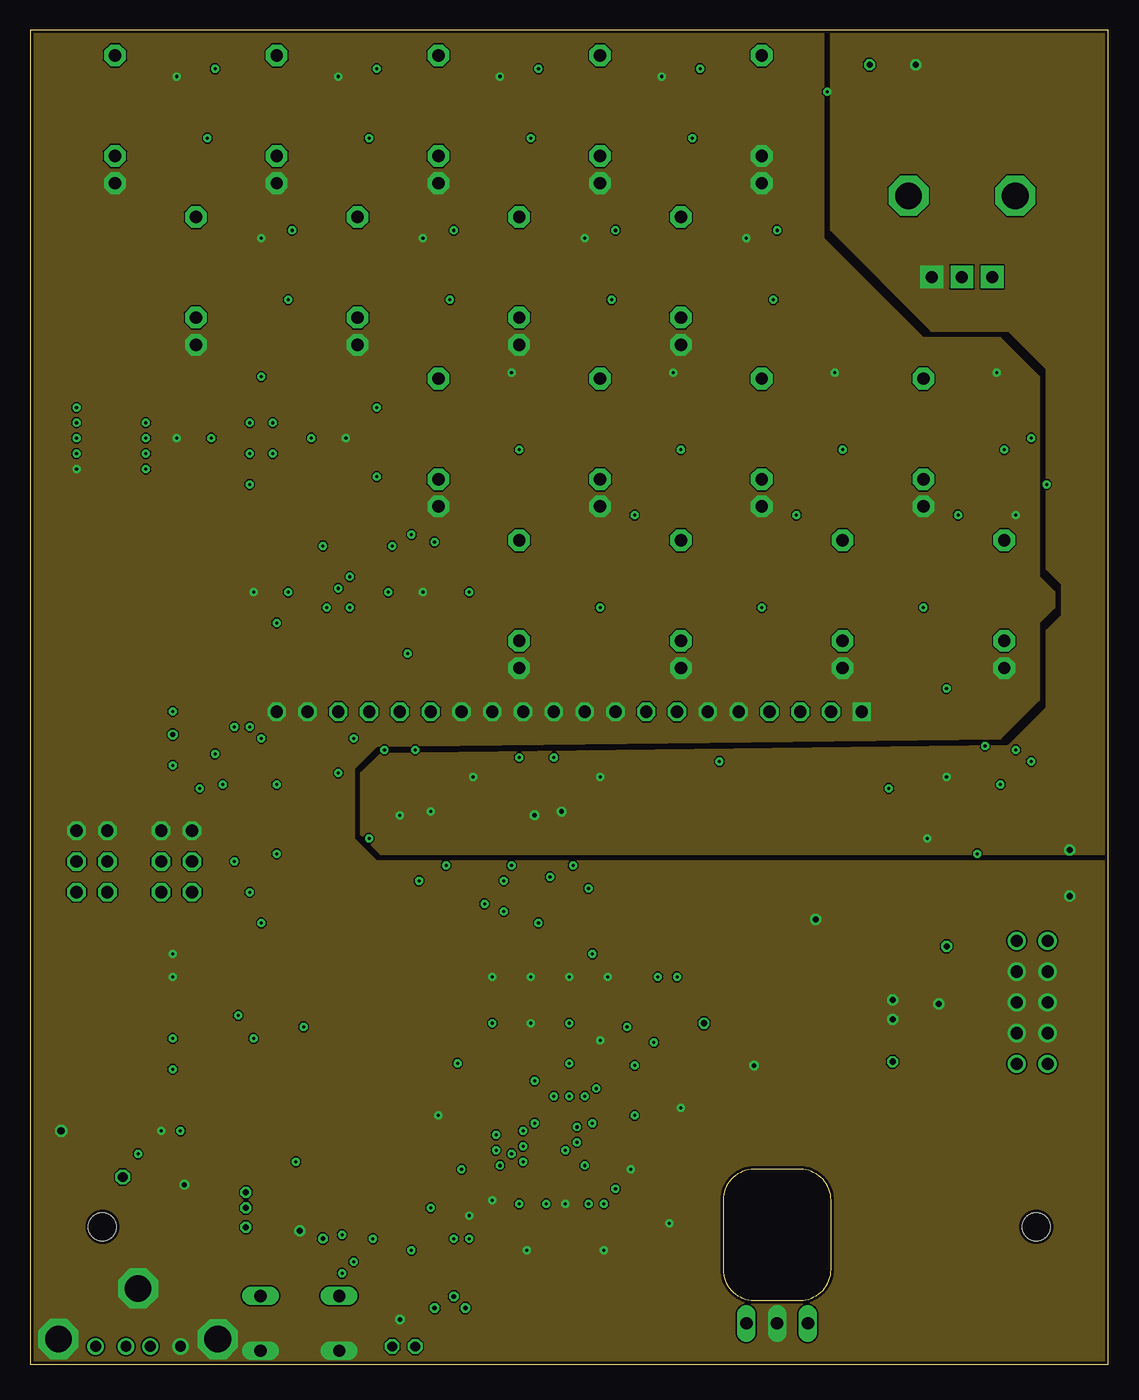
[diagram p4: board, inner layer GND]
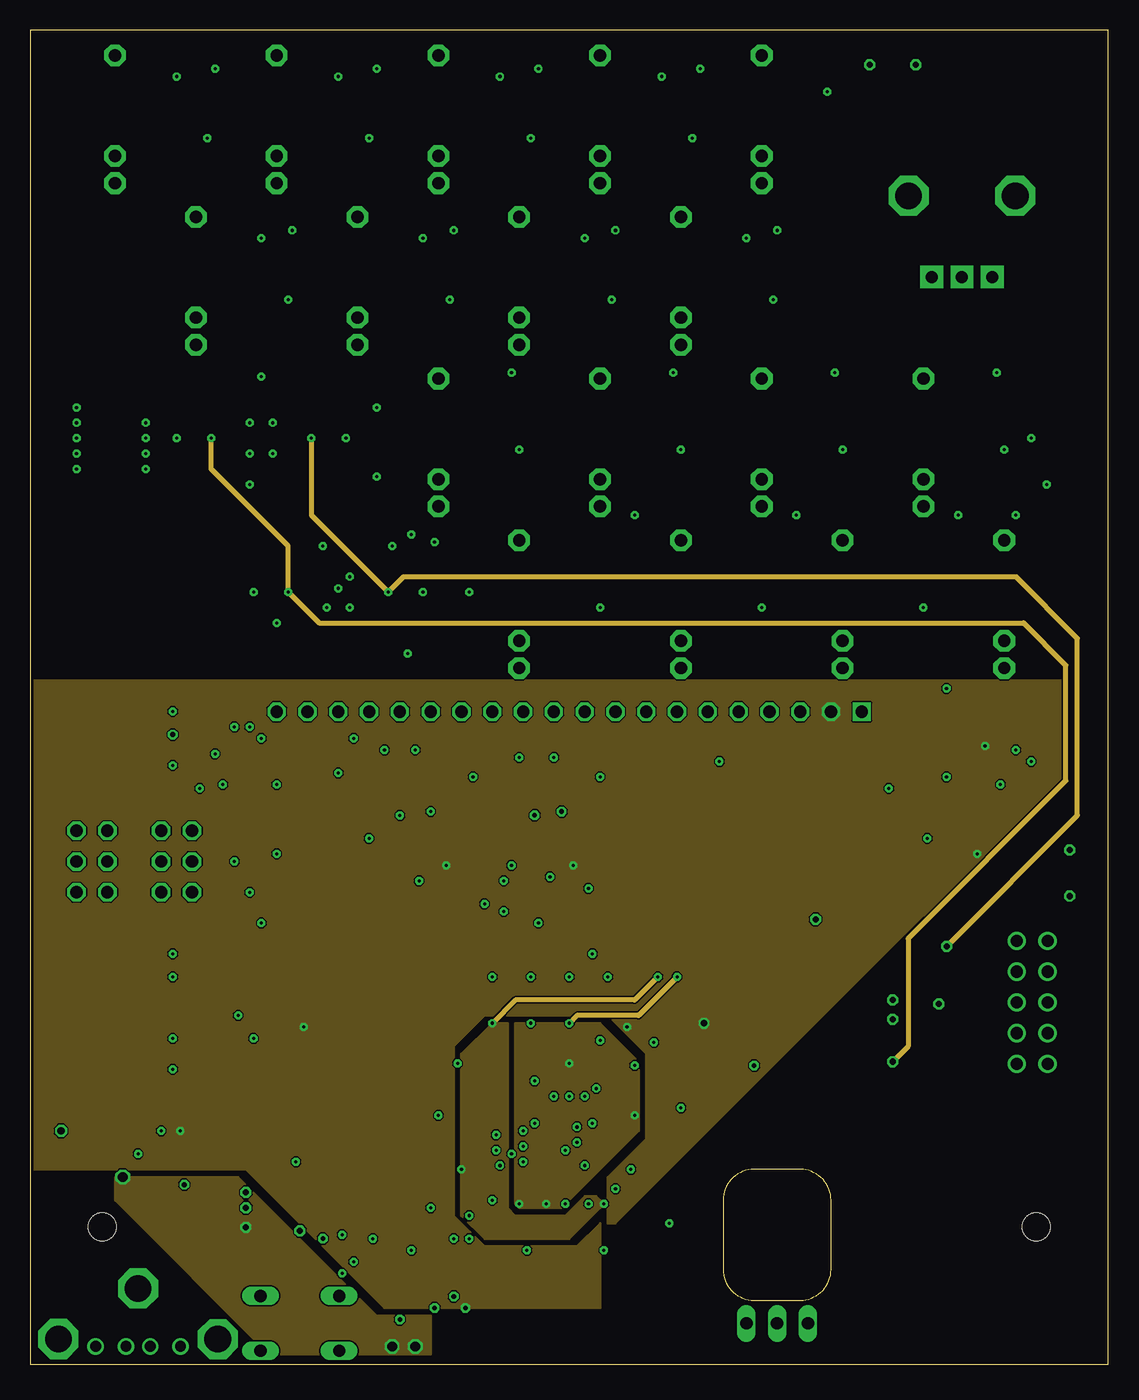
[diagram p5: board, inner layer PWR]
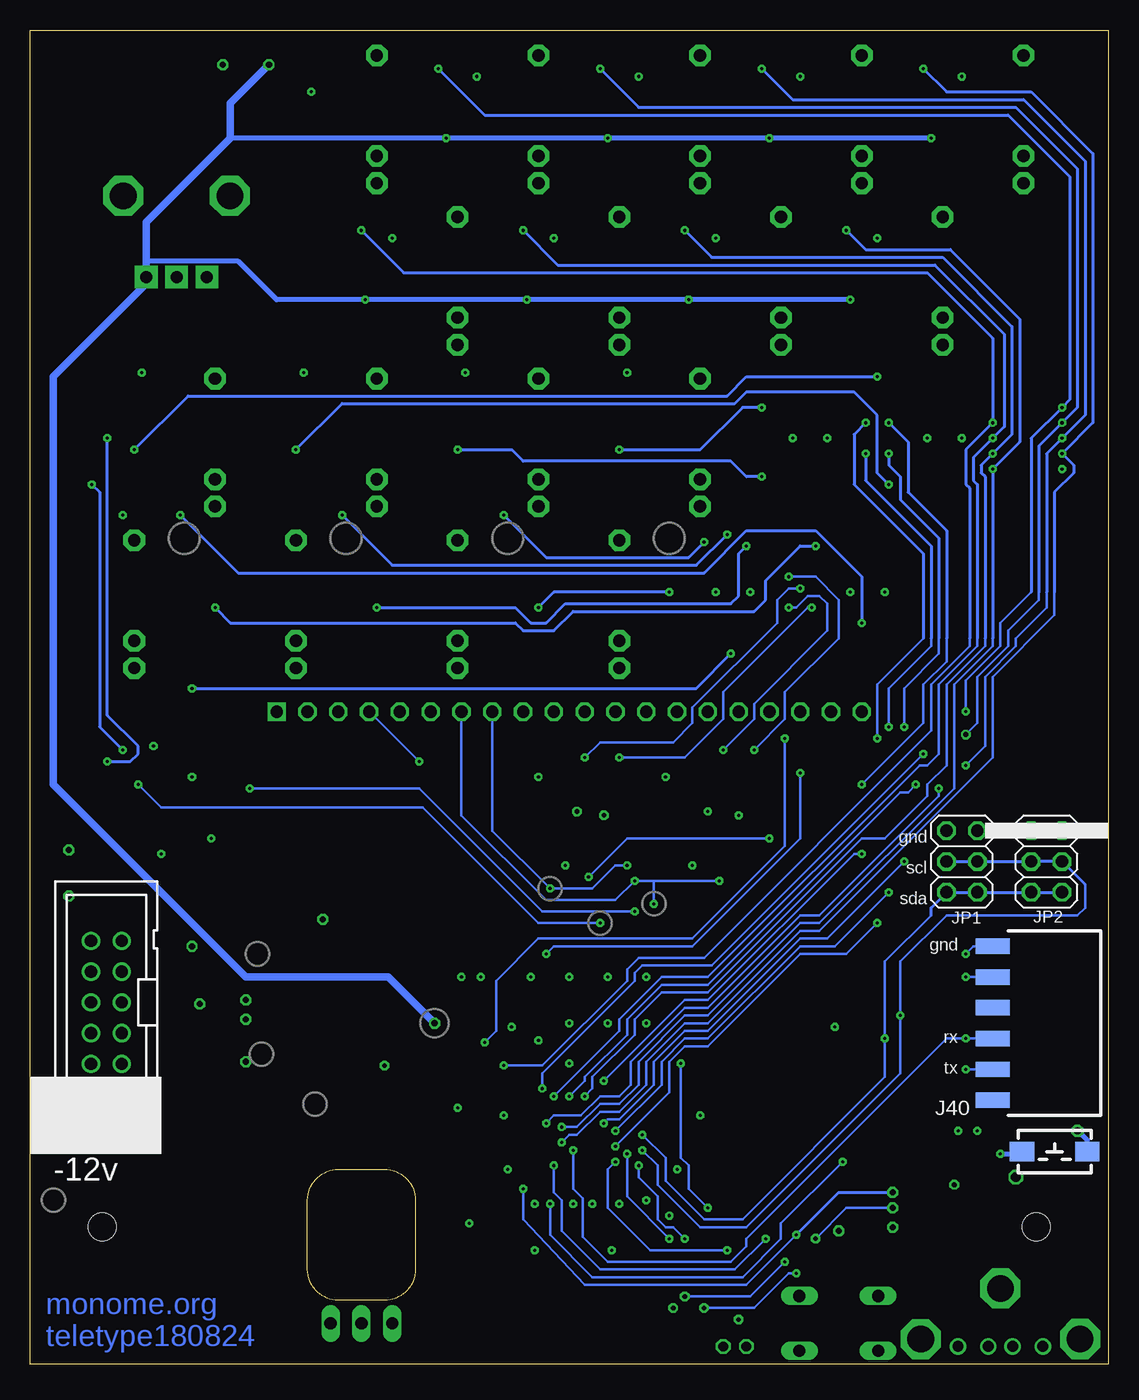
[diagram p6: board, bottom side, seen from below]

Size 88.9 x 110.05 mm. Coordinates in mm from the lower left corner, seen from the top.
Outline: 0,0 88.9,0 88.9,110.05 0,110.05 0,0
Outline: 57.15,13.53 57.15,7.81 arc90 59.69,5.27 63.5,5.27 arc90 66.04,7.81 66.04,13.53 arc90 63.5,16.07 59.69,16.07 arc90 57.15,13.53
Copper layers (1*2+3*16): Top 0.035mm / dielectric 1.5mm / GND 0.035mm / dielectric 0.15mm / PWR 0.035mm / dielectric 0.2mm / Bottom 0.035mm
Design rules "default *": minimum track width 5mil, minimum drill 8mil, track to track 5mil, track to pad 5mil, pad to pad 5mil, via to via 5mil, smd to smd 0mil, copper to edge 10mil, drill to drill 12mil, minimum pad ring 1mil, minimum via ring 8mil, stop-mask expansion 2mil, vias tented up to drill 0mil, thermal gap 0mil

### Footprints (pad centres in the part's own frame; a part is rotated, then mirrored left to right if it is on the bottom)
C0402 = smd 0.6 x 0.6: 1 -0.508,0; 2 0.508,0
C7343-43 = smd 2.6 x 2.4: + 3.175,0; - -3.175,0
C1206/T = smd 1.4 x 1.9: + 1.27,0; - -1.27,0
C0603 = smd 0.9 x 0.8: 1 -0.762,0; 2 0.762,0
C0402' = smd 0.7 x 0.9: 1 -0.65,0; 2 0.65,0
SOT23 = smd 1 x 1.4: 1 -0.95,-1.1; 2 0.95,-1.1; 3 0,1.1
SO14 = smd 0.6 x 2.2: 1 -3.81,-2.6; 2 -2.54,-2.6; 3 -1.27,-2.6; 4 0,-2.6; 5 1.27,-2.6; 6 2.54,-2.6; 7 3.81,-2.6; 8 3.81,2.6; 9 2.54,2.6; 10 1.27,2.6; 11 0,2.6; 12 -1.27,2.6; 13 -2.54,2.6; 14 -3.81,2.6
TO220V = drill 1.016 long: 1 -2.54,-2.54; 2 0,-2.54; 3 2.54,-2.54
WQP-PJ301M-12_JACK = drill 1.016 pad 1.778 octagon: SLEEVE 0,-5.63; TIP 0,4.92; TS 0,-3.38
ISP-ROW = smd 1.27 x 2.794: 1 -6.35,0; 2 -3.81,0; 3 -1.27,0; 4 1.27,0; 5 3.81,0; 6 6.35,0
2X03 = drill 1.016 octagon: 1 -2.54,-1.27; 2 -2.54,1.27; 3 0,-1.27; 4 0,1.27; 5 2.54,-1.27; 6 2.54,1.27
CHIP-LED0805 = smd 1.2 x 1.2: A 0,-1.05; C 0,1.05
ALPS_POT_VERTICAL = drill 1 pad 1.88 square: P$1 -2.5,6.7; P$2 0,6.7; P$3 2.5,6.7 | drill 2.2 pad 3.175 octagon: P$4 -4.4,0; P$5 4.4,0
F1206 = smd 1.6 x 1.803: 1 -1.429,0; 2 1.429,0
SWITCH-OMRON_B3F-10XX = drill 1.016 long: 1 -3.251,2.261; 2 3.251,2.261; 3 -3.251,-2.261; 4 3.251,-2.261
R0402 = smd 0.6 x 0.6: 1 -0.508,0; 2 0.508,0
R0402' = smd 0.7 x 0.9: 1 -0.65,0; 2 0.65,0
R0603 = smd 0.9 x 0.8: 1 -0.762,0; 2 0.762,0
MNR35 = smd 0.9 x 1.4: 1 -2.54,1.587; 2 -1.27,1.587; 3 0,1.587; 4 1.27,1.587; 5 2.54,1.587; 6 2.54,-1.587; 7 1.27,-1.587; 8 0,-1.587; 9 -1.27,-1.587; 10 -2.54,-1.587
PANASONIC-EVQ = smd 2 x 1.6: 1 2.7,0; 2 -2.7,0
SO08 = smd 0.6 x 2.2: 1 -1.905,-2.6; 2 -0.635,-2.6; 3 0.635,-2.6; 4 1.905,-2.6; 5 1.905,2.6; 6 0.635,2.6; 7 -0.635,2.6; 8 -1.905,2.6
TQFP64-10X10 = smd 1.5 x 0.28: 1 -5.8,3.75; 2 -5.8,3.25; 3 -5.8,2.75; 4 -5.8,2.25; 5 -5.8,1.75; 6 -5.8,1.25; 7 -5.8,0.75; 8 -5.8,0.25; 9 -5.8,-0.25; 10 -5.8,-0.75; 11 -5.8,-1.25; 12 -5.8,-1.75; 13 -5.8,-2.25; 14 -5.8,-2.75; 15 -5.8,-3.25; 16 -5.8,-3.75; 33 5.8,-3.75; 34 5.8,-3.25; 35 5.8,-2.75; 36 5.8,-2.25; 37 5.8,-1.75; 38 5.8,-1.25; 39 5.8,-0.75; 40 5.8,-0.25; 41 5.8,0.25; 42 5.8,0.75; 43 5.8,1.25; 44 5.8,1.75; 45 5.8,2.25; 46 5.8,2.75; 47 5.8,3.25; 48 5.8,3.75 | smd 0.28 x 1.5: 17 -3.75,-5.8; 18 -3.25,-5.8; 19 -2.75,-5.8; 20 -2.25,-5.8; 21 -1.75,-5.8; 22 -1.25,-5.8; 23 -0.75,-5.8; 24 -0.25,-5.8; 25 0.25,-5.8; 26 0.75,-5.8; 27 1.25,-5.8; 28 1.75,-5.8; 29 2.25,-5.8; 30 2.75,-5.8; 31 3.25,-5.8; 32 3.75,-5.8; 49 3.75,5.8; 50 3.25,5.8; 51 2.75,5.8; 52 2.25,5.8; 53 1.75,5.8; 54 1.25,5.8; 55 0.75,5.8; 56 0.25,5.8; 57 -0.25,5.8; 58 -0.75,5.8; 59 -1.25,5.8; 60 -1.75,5.8; 61 -2.25,5.8; 62 -2.75,5.8; 63 -3.25,5.8; 64 -3.75,5.8
TSSOP16 = smd 0.3 x 1.5: 1 -2.275,-2.8; 2 -1.625,-2.8; 3 -0.975,-2.8; 4 -0.325,-2.8; 5 0.325,-2.8; 6 0.975,-2.8; 7 1.625,-2.8; 8 2.275,-2.8; 9 2.275,2.8; 10 1.625,2.8; 11 0.975,2.8; 12 0.325,2.8; 13 -0.325,2.8; 14 -0.975,2.8; 15 -1.625,2.8; 16 -2.275,2.8
SOT223 = smd 1.219 x 2.235: 1 -2.311,-3.099; 2 0,-3.099; 3 2.311,-3.099 | smd 3.6 x 2.2: 4 0,3.099
OLED-ALEPH = drill 1 pad 1.5 square: 1 24.13,21.25 | drill 1 pad 1.5 octagon: 2 21.59,21.25; 3 19.05,21.25; 4 16.51,21.25; 5 13.97,21.25; 6 11.43,21.25; 7 8.89,21.25; 8 6.35,21.25; 9 3.81,21.25; 10 1.27,21.25; 11 -1.27,21.25; 12 -3.81,21.25; 13 -6.35,21.25; 14 -8.89,21.25; 15 -11.43,21.25; 16 -13.97,21.25; 17 -16.51,21.25; 18 -19.05,21.25; 19 -21.59,21.25; 20 -24.13,21.25 | hole 2.286: 38.5,-21.25; -38.5,-21.25
SHAPES_PONY_MOLEX-USB = drill 0.9 pad 1.3: 1 -3.5,-1.9; 2 -1,-1.9; 3 1,-1.9; GND 3.5,-1.9 | drill 2.2 pad 3.175 octagon: M1 -6.575,-1.295; M2 6.575,-1.305; M4 0,2.88
PAK100/2500-10 = drill 1 pad 1.422: 1 -5.08,-1.27; 2 -5.08,1.27; 3 -2.54,-1.27; 4 -2.54,1.27; 5 0,-1.27; 6 0,1.27; 7 2.54,-1.27; 8 2.54,1.27; 9 5.08,-1.27; 10 5.08,1.27
HC49UP = smd 5.334 x 1.93: 1 -4.763,0; 2 4.763,0

### Placement (x,y rotation side)
C1  71.12,26.23 270 top
C2  5.71,19.24 270 top
C3  71.12,32.26 90 top
C4  73.66,26.54 90 top
C5  12.7,12.26 270 top
C6  73.66,32.58 90 top
C7  10.79,8.45 0 top
C8  51.75,21.15 180 top
C9  51.75,22.73 180 top
C10  47.31,11.3 90 top
C11  47.62,30.04 270 top
C12  44.45,30.04 270 top
C13  41.27,30.04 270 top
C14  42.55,11.3 90 top
C15  40.96,11.3 90 top
C16  38.1,30.04 270 top
C17  36.2,14.16 90 top
C18  34.61,14.16 90 top
C19  33.66,18.61 270 top
C20  33.66,22.42 90 top
C21  100n  [C0402']  24.77,76.39 0 top
C22  100n  [C0402']  13.34,76.39 0 top
C23  100n  [C0402']  31.11,63.69 0 top
C24  46.99,45.59 270 top
C25  75.56,40.83 0 top
C26  49.21,45.59 270 top
C27  75.56,43.37 0 top
C28  36.51,45.59 270 top
C29  75.56,50.99 0 top
C30  38.73,45.59 270 top
C31  30.48,4.95 270 top
C32  100n  [C0402']  19.68,63.69 0 top
C33  33n  [C0402']  75.56,85.92 90 top
C34  1n  [C0402']  66.99,106.87 180 top
C35  1n  [C0402']  20.32,93.54 180 top
C36  1n  [C0402']  26.99,106.87 180 top
C37  1n  [C0402']  13.65,106.87 180 top
C38  1n  [C0402']  33.66,93.54 180 top
C39  1n  [C0402']  40.32,106.87 180 top
C41  10.79,17.34 90 top
C42  61.59,24.64 0 top
C43  1n  [C0402']  46.99,93.54 180 top
C44  61.91,36.7 180 top
C45  51.75,19.56 180 top
C46  51.75,17.97 180 top
C47  45.72,11.3 90 top
C48  49.21,30.04 270 top
C49  48.9,11.3 90 top
C50  46.04,30.04 270 top
C51  42.86,30.04 270 top
C52  44.13,11.3 90 top
C53  39.69,30.04 270 top
C54  39.37,11.3 90 top
C55  37.78,11.3 90 top
C56  36.51,30.04 270 top
C57  1n  [C0402']  53.66,106.87 180 top
C58  1n  [C0402']  60.33,93.54 180 top
C59  54.61,9.08 270 top
C60  52.7,9.08 270 top
D2  20.32,90.36 0 top
D3  13.65,103.7 0 top
D4  26.99,103.7 0 top
D5  33.66,90.36 0 top
D6  40.32,103.7 0 top
D7  46.99,90.36 0 top
D8  53.66,103.7 0 top
D9  60.33,90.36 0 top
IC1  19.05,76.39 90 top
IC2  61.59,0.83 180 top
IC4  25.4,63.69 90 top
J1  6.99,103.06 0 top
J2  13.65,89.73 0 top
J3  20.32,103.06 0 top
J4  26.99,89.73 0 top
J5  33.66,103.06 0 top
J6  40.32,89.73 0 top
J7  46.99,103.06 0 top
J8  53.66,89.73 0 top
J9  33.66,76.39 0 top
J10  46.99,76.39 0 top
J11  60.33,76.39 0 top
J12  73.66,76.39 0 top
J13  40.32,63.06 0 top
J14  53.66,63.06 0 top
J15  66.99,63.06 0 top
J16  80.33,63.06 0 top
J17  60.33,103.06 0 top
J40  9.53,28.13 270 bottom
JP1  12.06,41.47 90 bottom
JP2  5.08,41.47 90 bottom
LED1  40.32,80.2 0 top
LED2  53.66,80.2 0 top
LED3  66.99,80.2 0 top
LED4  80.33,80.2 0 top
LED5  46.99,66.87 0 top
LED6  60.33,66.87 0 top
LED7  73.66,66.87 0 top
LED8  87,66.87 0 top
P1  76.83,96.39 180 top
PF1  77.79,25.27 180 top
PF2  77.79,34.48 180 top
POP  22.23,3.37 0 top
R1  23.5,14.16 180 top
R2  23.5,12.26 180 top
R3  1k  [R0402']  40.32,73.85 270 top
R4  28.89,4.95 270 top
R5  20.64,26.86 0 top
R6  10k  [R0402']  40.32,77.03 90 top
R7  10k  [R0402']  53.66,77.03 90 top
R8  1k  [R0402']  53.66,73.85 270 top
R9  10k  [R0402']  66.99,77.03 90 top
R10  1k  [R0402']  80.33,73.85 270 top
R11  10k  [R0402']  80.33,77.03 90 top
R12  10k  [R0402']  24.77,77.66 180 top
R13  10k  [R0402']  24.77,75.12 180 top
R14  1k  [R0402']  66.99,73.85 270 top
R15  30k  [R0402']  64.77,70.04 0 top
R16  20.64,28.77 0 top
R17  1k  [R0402']  73.66,61.15 270 top
R18  10k  [R0402']  76.83,85.92 270 top
R19  30k  [R0402']  38.1,70.04 0 top
R20  31k6  [R0402']  74.3,85.92 90 top
R21  1k  [R0402']  46.99,61.15 270 top
R22  10k  [R0402']  13.34,75.12 0 top
R23  30k  [R0402']  78.11,70.04 0 top
R24  30k  [R0402']  66.99,108.14 0 top
R25  30k  [R0402']  51.44,70.04 0 top
R26  10k  [R0402']  66.99,105.6 0 top
R27  30k  [R0402']  20.32,94.81 0 top
R28  10k  [R0402']  13.34,77.66 0 top
R29  1k  [R0402']  60.33,61.15 270 top
R30  30k  [R0402']  26.99,108.14 0 top
R31  10k  [R0402']  31.11,62.42 180 top
R32  30k  [R0402']  13.65,108.14 0 top
R33  10k  [R0402']  31.11,64.96 180 top
R34  30k  [R0402']  33.66,94.81 0 top
R35  10k  [R0402']  19.68,64.96 0 top
R36  30k  [R0402']  40.32,108.14 0 top
R37  20k  [R0402']  24.13,73.22 270 top
R38  20k  [R0402']  24.13,79.57 90 top
R39  10k  [R0402']  19.68,62.42 0 top
R40  12.38,17.34 90 top
R41  51.75,30.04 270 top
R42  53.34,30.04 270 top
R43  17.78,7.49 180 top
R44  17.78,9.08 180 top
R45  85.72,40.51 270 top
R46  20k  [R0402']  13.97,73.22 270 top
R47  20k  [R0402']  13.97,79.57 90 top
R48  50.8,4.64 0 top
R51  1k  [R0402']  87,61.15 270 top
R52  20k  [R0402']  73.66,63.69 90 top
R53  20k  [R0402']  87,63.69 90 top
R56  30k  [R0402']  46.99,94.81 0 top
R58  30k  [R0402']  53.66,108.14 0 top
R60  30k  [R0402']  60.33,94.81 0 top
R66  20k  [R0402']  46.99,63.69 90 top
R67  20k  [R0402']  60.33,63.69 90 top
RN1  6.67,76.39 270 top
SW40  4.42,17.52 0 bottom
U1  17.78,12.89 90 top
U2  42.55,20.51 180 top
U3  31.75,45.59 180 top
U4  42.55,45.59 180 top
U6  77.79,29.72 90 top
U7  75.56,47.18 270 top
U40  61.59,30.35 0 top
U44  71.12,107.19 180 top
U$1  44.45,32.58 0 top
USB  8.89,3.37 0 top
X1  82.63,29.84 90 bottom
Y1  29.84,20.51 90 top

### Tracks (layer width: path | path; a pad name or v marks a point on that pad's centre or on a via)
+3V3  (via drill 0.25, 0.38, 0.5)
  Top 0.203: C29.2 v78.74,50.99 79.69,50.04 79.69,49.09 79.41,48.81 U7.15 | 42.86,45.28 44.17,43.97 U4.15 44.17,41.75 v44.77,41.15 45.72,41.15 46.99,42.42 C24.+ 47.18,44.83 C26.2 | 42.86,45.28 42.22,45.92 U4.5 | U4.11 41.57,43.98 42.86,45.28 | 31.91,45.43 33.38,43.97 U3.15 33.38,42.06 v34.29,41.15 35.56,41.15 36.51,42.1 C28.+ 37.02,44.83 C30.2 | 31.91,45.43 31.43,45.92 U3.5 | U3.11 30.77,44.3 31.91,45.43 | U7.6 U7.5 73.67,46.86 76.07,44.45 C27.2 | U2.19 45.3,27.07 45.72,27.5 | 45.72,27.5 47.62,27.5 47.94,27.81 v49.21,27.81 | U2.18 45.8,27.42 45.72,27.5 | U44.2 70.17,108.14 | R16.2 21.59,28.77 v22.54,27.81 21.59,26.86 R5.2
  Top 0.254: C27.2 76.07,42.23 76.83,41.47 C25.+
  Top 0.406: C44.+ 60.64,34.4 U40.4 U40.2 | R4.2 28.89,3.68 29.84,2.73 33.97,2.73 v35.88,4.64 | R40.2 v12.38,19.24 | C25.+ v78.11,42.1 | 70.17,108.14 v69.22,107.19 | R41.2 51.75,29.21 | D3.2 v14.6,101.16 v14.61,101.16 | D8.2 v54.61,101.16 | D6.2 v41.27,101.16 | D4.2 v27.94,101.16 | D2.2 v21.27,87.82 | D5.2 v34.6,87.82 v34.61,87.82 | D7.2 v47.94,87.82 | D9.2 v61.27,87.82 v61.28,87.82
  Top 0.61: U40.4 60.64,33.21 v55.56,28.13 53.02,28.13 52.61,28.54 | R42.2 52.61,28.54 | 51.75,29.21 51.94,29.21 52.61,28.54
  Bottom 0.406: v14.61,101.16 v27.94,101.16 v41.27,101.16 v54.61,101.16 72.39,101.16 | v21.27,87.82 v34.61,87.82 v47.94,87.82 v61.28,87.82 68.58,87.82 71.75,91 79.33,91
  Bottom 0.61: v55.56,28.13 59.37,31.94 71.12,31.94 87,47.82 87,81.47 79.57,88.89 P1.P$1 79.33,91 79.33,94.21 72.39,101.16 72.39,104.01 v69.22,107.19
  pour PWR: 47.62,11.62 48.26,11.62 73.66,37.02 78.74,37.02 85.09,43.37 85.09,56.39 0,56.39 0,16.07 17.78,16.07 29.21,4.64 46.99,4.64 46.99,11.62 45.09,9.72 37.47,9.72 34.92,12.26 34.92,26.23 37.47,28.77 47.62,28.77 50.8,25.59 50.8,18.61 47.62,15.43
+5V  (via drill 0.5, 0.8)
  Top 0.254: R2.2 U1.2 | R1.2 22.54,14.16 21.91,13.53 U1.3
  Top 0.61: v17.78,11.3 18.73,12.26 U1.2 U1.3
  Top 0.813: C2.+ 6.35,15.43 v7.62,15.43
  other vias: 29.84,1.46 31.75,1.46
  pour Top: 66.04,28.13 66.04,19.88 62.23,16.07 62.23,7.18 60.33,5.27 60.33,0.19 28.57,0.19 28.57,4 51.44,4 51.44,14.16 65.41,28.13
  pour PWR: 33.02,4 33.02,0.83 19.68,0.83 6.99,13.53 6.99,15.43 17.14,15.43 28.57,4
+12V  (via drill 0.25, 0.5)
  Top 0.254: IC1.4 v23.18,76.39 C21.1 | IC4.4 v29.53,63.69 C23.1
  Top 0.61: PF2.2 76.52,34.48 76.52,33.04 U6.2
  Top 0.813: PF2.2 v75.56,34.48 74.3,34.48 C6.+
  PWR 0.406: v75.56,34.48 86.36,45.28 86.36,59.88 81.28,64.96 30.8,64.96 v29.53,63.69 23.18,70.04 v23.18,76.39
  pour Top: 76.2,34.48 73.66,34.48 71.75,32.58 70.48,32.58 69.85,31.94 69.85,0.19 62.87,0.19 62.87,15.43 66.67,19.24 66.67,32.58 69.85,35.75 76.2,35.75 76.83,35.12
+IN
  Top 0.813: X1.10 X1.9 79.18,34.92 PF2.1
-12V  (via drill 0.25, 0.5)
  Top 0.254: C22.2 v14.92,76.39 IC1.11 | IC4.11 v21.27,63.69 C32.2
  Top 0.406: v71.12,24.96 70.99,25.59 C1.2
  Top 0.61: PF1.2 76.52,25.27 76.52,26.4 U6.1
  Top 0.813: PF1.2 C4.- 71.31,25.27 C1.2
  PWR 0.406: v71.12,24.96 72.39,26.23 72.39,35.12 85.41,48.13 85.41,57.66 81.92,61.15 23.81,61.15 v21.27,63.69 21.27,67.5 14.92,73.85 v14.92,76.39
-IN
  Top 0.813: X1.2 X1.1 79.25,24.76 PF1.1
A00  (via drill 0.25)
  Top 0.203: U2.3 45.61,17.76 v45.09,18.29
  Top 0.254: RN1.7 v3.81,75.12 | R32.2 C37.1 | C37.1 14.3,105.45 D3.3 | v15.24,106.87 C37.1
  Bottom 0.203: 4.45,63.69 4.45,61.79 9.53,56.71 9.53,50.04 23.81,35.75 25.4,35.75 33.02,28.13 34.92,28.13 38.1,24.96 38.1,23.05 40.32,20.83 41.91,20.83 43.81,18.92 44.45,18.92 v45.09,18.29
  Bottom 0.254: 4.45,63.69 4.45,71.95 2.86,73.53 2.86,74.17 v3.81,75.12 1.27,77.66 1.27,99.89 6.35,104.97 13.34,104.97 v15.24,106.87
A01  (via drill 0.25)
  Top 0.203: U2.4 46.38,18.26 v45.09,19.56
  Top 0.254: RN1.5 v9.53,73.85 | R27.2 C35.1 | C35.1 20.97,92.11 D2.3 | v21.59,93.54 C35.1
  Bottom 0.203: 9.53,59.88 9.53,59.25 12.7,56.07 12.7,47.5 23.81,36.39 25.4,36.39 33.02,28.77 34.92,28.77 38.73,24.96 38.73,23.05 40.32,21.46 41.91,21.46 43.81,19.56 v45.09,19.56
  Bottom 0.254: 9.53,59.88 v9.53,73.85 7.3,76.07 7.3,86.23 13.02,91.95 20,91.95 v21.59,93.54
A02  (via drill 0.25)
  Top 0.203: U2.5 46.84,18.76 46.35,19.24 v46.35,19.88 | v13.97,47.5 13.65,47.5 v11.75,49.4
  Top 0.254: RN1.8 v3.81,76.39 | C36.1 R30.2 | C36.1 27.64,105.45 D4.3 | v28.57,106.87 C36.1
  Bottom 0.203: 5.08,63.69 5.08,62.42 7.62,59.88 7.62,59.25 10.16,56.71 10.16,50.99 v11.75,49.4 | v46.35,19.88 45.72,20.51 43.5,20.51 41.91,22.1 40.32,22.1 39.37,23.05 39.37,24.96 34.92,29.4 33.02,29.4 25.4,37.02 23.81,37.02 13.97,46.86 v13.97,47.5
  Bottom 0.254: 5.08,63.69 5.08,75.12 v3.81,76.39 1.91,78.3 1.91,99.25 6.99,104.33 26.04,104.33 v28.57,106.87
A03  (via drill 0.25)
  Top 0.203: U2.9 44.52,20.76 v43.18,22.1
  Top 0.254: RN1.4 v9.53,75.12 | C38.1 34.3,92.11 D5.3 | v34.92,93.54 C38.1 | R34.2 C38.1
  Bottom 0.203: 10.16,59.88 10.16,59.25 13.34,56.07 13.34,49.4 14.92,47.82 14.92,46.86 18.41,43.37 20.32,43.37 33.02,30.67 36.83,30.67 39.05,28.45 39.05,27.18 42.55,23.69 42.55,22.73 v43.18,22.1
  Bottom 0.254: 10.16,59.88 10.16,73.22 10.48,73.53 10.48,74.17 v9.53,75.12 7.94,76.71 7.94,85.6 13.65,91.31 32.7,91.31 v34.92,93.54
A04  (via drill 0.25, 0.38)
  Top 0.203: U2.10 45.29,21.26 v44.45,22.1 | v11.75,51.94 v15.88,47.82
  Top 0.254: RN1.9 v3.81,77.66 | R36.2 C39.1 | C39.1 40.97,105.45 D6.3 | v41.91,106.87 C39.1
  Bottom 0.203: 5.71,63.69 5.71,63.06 8.26,60.52 8.26,59.25 10.79,56.71 10.79,52.9 v11.75,51.94 | v44.45,22.1 43.18,23.37 43.18,23.69 39.69,27.18 39.69,28.45 36.83,31.31 33.02,31.31 17.14,47.18 16.51,47.18 v15.88,47.82
  Bottom 0.254: 5.71,63.69 5.71,75.76 v3.81,77.66 2.54,78.93 2.54,98.62 7.62,103.7 38.73,103.7 v41.91,106.87
A05  (via drill 0.25)
  Top 0.203: U2.11 46.06,21.76 v45.72,22.1
  Top 0.254: RN1.3 v9.53,76.39 | C43.1 47.64,92.11 D7.3 | R56.2 C43.1 | v48.26,93.54 C43.1
  Bottom 0.203: 10.79,59.88 10.79,59.25 13.97,56.07 13.97,50.36 14.92,49.4 15.56,49.4 33.02,31.94 36.83,31.94 40.32,28.45 40.32,27.5 v45.72,22.1
  Bottom 0.254: 10.79,59.88 10.79,72.58 11.11,72.9 11.11,74.8 v9.53,76.39 8.57,77.34 8.57,84.96 14.29,90.68 45.4,90.68 v48.26,93.54
A06  (via drill 0.25)
  Top 0.203: U2.12 47.15,22.26 v46.67,22.73 | v15.24,50.36 v11.75,53.85
  Top 0.254: RN1.10 v3.81,78.93 | R58.2 C57.1 | C57.1 54.31,105.45 D8.3 | v55.24,106.87 C57.1
  Bottom 0.203: 6.35,63.69 8.89,61.15 8.89,59.25 11.75,56.39 v11.75,53.85 | v46.67,22.73 46.67,24 39.05,31.62 39.05,32.26 38.42,32.89 32.7,32.89 v15.24,50.36
  Bottom 0.254: 6.35,63.69 6.35,76.39 v3.81,78.93 3.17,79.57 3.17,97.98 8.26,103.06 51.44,103.06 v55.24,106.87
A07  (via drill 0.25)
  Top 0.203: U2.13 49.24,22.76 49.85,23.37 v49.85,24.64
  Top 0.254: RN1.2 v9.53,77.66 | R60.2 C58.1 | C58.1 60.98,92.11 D9.3 | v61.59,93.54 C58.1
  Bottom 0.203: 11.43,59.88 11.43,59.25 14.61,56.07 14.61,52.26 33.34,33.53 38.73,33.53 39.69,32.58 39.69,31.62 46.67,24.64 v49.85,24.64
  Bottom 0.254: 11.43,59.88 11.43,72.26 11.75,72.58 11.75,75.44 v9.53,77.66 9.53,84.65 14.92,90.04 58.1,90.04 v61.59,93.54
AGND  (via drill 0.25, 0.38, 0.5)
  Top 0.203: U7.4 74.62,47.51 v75.56,48.45 | v75.56,48.45 76.51,47.51 U7.13 76.53,47.51 76.52,47.5 76.52,46.55 77.51,45.56 U7.10 U7.9 | U7.16 76.57,49.46 v75.56,48.45 | v73.98,43.37 C27.1 | U4.16 44.82,44.59 v43.81,45.59 42.87,46.54 U4.4 | U3.16 34.02,44.59 v33.02,45.59 32.08,46.54 U3.4 | U3.9 U3.10 30.12,44.92 v30.48,45.28 | v41.59,45.28 40.92,44.6 U4.10 U4.9 | C30.1 37.02,46.35 C28.- v36.51,48.45 | C26.1 47.5,46.35 C24.- v46.99,48.45 | C29.1 75.06,48.96 v75.56,48.45 | R45.1 v85.72,42.42 | U44.1 72.07,108.14 v73.03,107.19
  Top 0.254: v65.72,104.97 R26.1 C34.2 | U7.8 73.39,44.91 73.98,44.32 v73.98,43.37 | C25.- 74.3,41.47 75.06,42.23 C27.1
  Top 0.406: P1.P$3 74.3,88.85 R20.2 C33.2
  pour GND: 88.9,110.05 88.9,42.1 28.89,42.1 27.3,43.69 27.3,48.77 28.89,50.36 80.64,50.99 83.82,54.17 83.82,60.52 85.09,61.79 85.09,64.33 83.82,65.6 83.82,82.11 80.64,85.28 74.3,85.28 66.04,93.54 66.04,110.05
B08  (via drill 0.25)
  Top 0.203: U2.54 41.3,16.09 41.59,16.38 41.59,17.02 v40.64,17.97 | v19.05,36.39 v19.05,51.63
  Top 0.254: IC1.5 v20,77.66
  Bottom 0.203: 15.24,59.88 19.05,56.07 v19.05,51.63 | v40.64,17.97 36.2,22.42 36.2,24.96 34.92,26.23 33.02,26.23 25.4,33.85 21.59,33.85 v19.05,36.39
  Bottom 0.254: v20,77.66 20.95,76.71 20.95,72.58 15.24,66.87 15.24,59.88
B09  (via drill 0.25)
  Top 0.203: U2.55 41.8,15.63 42.23,16.07 42.23,17.65 v40.64,19.24 | v18.1,52.58 v18.1,38.93
  Top 0.254: IC1.3 v20,75.12
  Bottom 0.203: 14.61,59.88 14.61,59.25 18.1,55.75 v18.1,52.58 | v40.64,19.24 36.83,23.05 36.83,24.96 34.92,26.86 33.02,26.86 25.4,34.48 22.54,34.48 v18.1,38.93
  Bottom 0.254: v20,75.12 20,72.9 14.61,67.5 14.61,59.88
B10  (via drill 0.25)
  Top 0.203: U2.57 42.8,17.72 41.59,18.92 v41.59,19.88 | v16.83,52.58 v16.83,41.47
  Top 0.254: IC1.12 v18.1,75.12
  Bottom 0.203: 13.97,59.88 13.97,58.61 16.83,55.75 v16.83,52.58 | v41.59,19.88 41.27,20.19 40.32,20.19 37.47,23.05 37.47,24.96 34.92,27.5 33.02,27.5 25.4,35.12 23.18,35.12 v16.83,41.47
  Bottom 0.254: v18.1,75.12 18.1,74.17 17.14,73.22 17.14,71.31 13.97,68.14 13.97,59.88
B11  (via drill 0.25)
  Top 0.203: U2.58 43.3,18.17 42.55,18.92 42.55,20.51 41.59,21.46 v41.59,23.37 | v20.32,42.1 v20.32,47.82
  Top 0.254: IC1.10 v18.1,77.66
  Bottom 0.203: 13.34,59.88 13.34,57.98 15.24,56.07 15.24,52.9 v20.32,47.82 | v41.59,23.37 34.92,30.04 33.02,30.04 20.95,42.1 v20.32,42.1
  Bottom 0.254: v18.1,77.66 16.51,76.07 16.51,71.95 13.34,68.77 13.34,59.88
CS0
  Top 0.203: U2.36 35.53,22.76 32.7,25.59 32.7,37.97 33.66,38.93 | 33.66,38.93 40.32,38.93 42.87,41.47 U4.13 | U3.13 32.08,41.14 33.66,39.56 33.66,38.93
CS1  (via drill 0.25)
  Top 0.203: U2.37 37.63,22.26 38.1,22.73 38.1,24.32 33.97,28.45 33.97,33.21 38.1,37.34 v39.05,37.34 | U7.3 71.46,48.16 v70.8,47.5
  Bottom 0.203: v39.05,37.34 46.67,37.34 56.83,47.5 v70.8,47.5
CS2  (via drill 0.25)
  Top 0.203: U2.27 41.3,24.94 43.18,23.05 45.72,23.05 48.26,25.59 50.48,25.59 v51.44,26.54 | v26.67,51.63 26.67,52.56 U$1.17
  Bottom 0.203: v51.44,26.54 50.48,27.5 50.48,31.62 46.99,35.12 34.29,35.12 26.67,42.74 v26.67,51.63
CV-IN0  (via drill 0.25)
  Top 0.203: U7.12 80.32,46.86 81.28,47.82 v81.28,50.67
  Top 0.254: R24.2 C34.1 R26.2
  Top 0.406: v83.82,72.58 83.82,89.09 73.03,99.89 73.03,104.18 U44.3 70.63,105.6 R26.2
  Bottom 0.254: v83.82,72.58 83.19,71.95 83.19,52.58 v81.28,50.67
CV-IN1  (via drill 0.25)
  Top 0.203: U7.11 80.94,46.21 82.55,47.82 v82.55,49.72
  Top 0.406: v82.55,76.39 82.55,82.85 80.14,85.27 R18.2 C33.1 R20.1
  Bottom 0.254: v82.55,49.72 80.64,49.72 80.01,50.36 80.01,50.99 82.55,53.53 v82.55,76.39
CV-OUT0  (via drill 0.25)
  Top 0.203: U3.3 32.73,49.7 v31.75,50.67
  Top 0.254: IC4.3 v26.35,62.42
  Bottom 0.203: v31.75,50.67 29.21,53.21 29.21,54.48 23.18,60.52 23.18,62.74 23.81,63.37 24.77,63.37 25.72,62.42 v26.35,62.42
CV-OUT1  (via drill 0.25)
  Top 0.203: U3.7 30.12,49.76 v29.21,50.67
  Top 0.254: IC4.5 v26.35,64.96
  Bottom 0.203: v26.35,64.96 24.13,64.96 22.23,63.06 22.23,59.88 26.67,55.44 26.67,53.21 v29.21,50.67
CV-OUT2  (via drill 0.25)
  Top 0.203: U4.3 43.52,49.7 v43.18,50.04
  Top 0.254: IC4.10 24.45,64.96 v25.4,64.01
  Bottom 0.203: v25.4,64.01 26.35,64.01 27.3,63.06 27.3,61.15 34.29,54.17 34.29,52.9 35.88,51.31 41.91,51.31 v43.18,50.04
CV-OUT3  (via drill 0.25)
  Top 0.203: U4.7 40.92,49.44 v40.32,50.04
  Top 0.254: IC4.12 v24.45,62.42
  Bottom 0.203: v24.45,62.42 24.77,62.42 31.75,55.44 31.75,53.21 34.92,50.04 v40.32,50.04
DM
  Top 0.406: USB.2 7.89,1.73 9.84,3.68 11.75,3.68 14.61,6.54 14.61,7.18 16.51,9.08 R44.2
DP
  Top 0.406: USB.3 9.89,1.83 10.79,2.73 12.06,2.73 16.83,7.49 R43.2
GND  (via drill 0.25, 0.38, 0.5, 0.6)
  Top 0.203: C18.1 C17.1 v36.2,12.26 | C19.1 v33.66,20.51 C20.1 | C15.1 C14.1 C52.1 | v41.27,28.13 41.91,27.5 43.18,27.5 43.3,27.38 U2.23 | U2.49 38.8,14.22 v38.1,13.53 | C15.1 v40.96,9.4 | U2.1 48.84,16.76 v49.53,16.07 | v47.62,31.94 C11.1 C48.1 | v38.1,31.94 C16.1 C56.1 | v53.66,21.15 C8.1 C45.1 C46.1 | C10.1 v47.31,9.4 | U2.17 46.35,26.7 v46.99,26.7 | R45.2 v85.72,38.61 | C47.1 C10.1 | C49.1 C10.1 | C55.1 C54.1 C15.1 | C50.1 C12.1 | C51.1 C12.1 | C12.1 v44.45,31.94 | C53.1 C13.1 v41.27,31.94 | U2.61 44.8,13.87 v44.13,13.21
  Top 0.254: v3.81,73.85 RN1.6 6.03,73.85 6.67,74.49 6.67,78.3 7.3,78.93 RN1.1 | LED1.C 40.1,81.25 40.1,81.37 v39.69,81.79 | 53.44,81.25 LED2.C 53.56,81.25 v53.02,81.79 | LED3.C 66.77,81.25 66.77,81.37 v66.36,81.79 | LED4.C 80.11,81.25 80.11,81.37 v79.69,81.79 | C37.2 12.7,106.87 v12.06,106.24 12.06,103.23 D3.1 | C36.2 26.04,106.87 v25.4,106.24 25.4,103.23 D4.1 | C39.2 39.37,106.87 v38.73,106.24 38.73,103.23 D6.1 | C57.2 52.7,106.87 v52.07,106.24 52.07,103.23 D8.1 | C35.2 v19.05,92.9 19.05,89.58 D2.1 | C38.2 v32.38,92.9 32.38,89.58 D5.1 | C43.2 v45.72,92.9 45.72,89.58 D7.1 | C58.2 v59.05,92.9 59.05,89.58 D9.1 | R13.1 C21.2 | C21.2 v26.04,76.39 | R12.1 C21.2 | R28.1 C22.1 | C22.1 v12.06,76.39 | R22.1 C22.1 | C23.2 v32.38,63.69 | R31.1 C23.2 | R33.1 C23.2 | v18.41,63.69 C32.1 | R39.1 C32.1 | R35.1 C32.1 | LED5.C J10.SLEEVE | LED6.C J11.SLEEVE | LED7.C J12.SLEEVE | LED8.C 87,68.14 85.09,70.04 v81.28,70.04
  Top 0.406: U1.1 v22.23,10.99 | C9.1 C8.1 | U40.1 59.28,25.04 v59.69,24.64 C42.1 | C44.- v64.77,36.7 | v30.48,3.68 C31.2 | C5.- v12.7,14.8 | C41.2 v10.79,19.24 | C7.1 9.84,8.45 8.89,7.49 USB.M4 | v52.7,11.62 C60.- 53.98,10.35 54.61,9.72 C59.1
  Top 0.61: U6.3 v74.93,29.72
  Top 0.813: C2.- v2.54,19.24
  Bottom 0.203: J40.2 v11.75,31.94 | J40.1 11.11,34.48 v11.75,33.85
  Bottom 0.406: SW40.1 1.72,18.47 v2.54,19.24
  other vias: 71.12,30.04 71.12,28.45
  pour GND: 0,0.06 88.9,0.06 88.9,41.47 28.57,41.47 26.67,43.37 26.67,49.09 28.57,50.99 80.01,51.63 83.19,54.8 83.19,61.15 84.45,62.42 84.45,63.69 83.19,64.96 83.19,81.47 80.01,84.65 73.66,84.65 65.41,92.9 65.41,110.05 0,110.05
  pour Top: 72.39,31.94 74.93,31.94 75.56,31.31 75.56,27.81 74.93,27.18 72.07,27.18 71.75,26.86 70.8,26.86 70.48,27.18 70.48,31.31 70.8,31.62 72.07,31.62
MISO  (via drill 0.25)
  Top 0.203: U2.41 37.85,20.26 38.73,21.15 38.73,24.32 34.61,28.45 34.61,32.89 38.1,36.39 v41.91,36.39 | U7.14 79.67,48.16 v80.01,47.82
  Bottom 0.203: v80.01,47.82 78.11,45.91 56.52,45.91 46.99,36.39 v41.91,36.39
MOSI  (via drill 0.25)
  Top 0.203: U3.14 32.73,41.44 33.97,40.2 37.78,40.2 38.73,41.15 v39.69,41.15 | U2.42 38.3,19.76 39.37,20.83 39.37,24.32 35.24,28.45 35.24,32.26 38.42,35.43 42.23,35.43 v46.04,39.24 | U7.2 71.4,48.81 68.58,51.63 53,51.63 U$1.8
  Bottom 0.203: v39.69,41.15 40.64,41.15 42.55,39.24 v46.04,39.24 50.8,44.01 U$1.8
N$1  (via drill 0.25, 0.38)
  Top 0.203: U2.51 39.8,17.23 v39.69,17.34 | v36.2,10.35 36.2,6.86 v34.92,5.59 | v26.67,8.45 22.86,8.45 22.23,9.08 R44.1
  Bottom 0.203: v39.69,17.34 39.69,13.84 v36.2,10.35 | v34.92,5.59 29.53,5.59 v26.67,8.45
N$2  (via drill 0.25, 0.38)
  Top 0.203: U2.50 39.3,15.82 v38.73,16.38 | v34.92,10.35 34.92,7.18 33.34,5.59 v33.34,4.64 | R43.1 v25.72,7.49
  Bottom 0.203: v38.73,16.38 38.73,15.43 37.15,13.84 37.15,11.94 36.51,11.3 35.88,11.3 v34.92,10.35 | v33.34,4.64 29.21,4.64 26.35,7.49 v25.72,7.49
N$3  (via drill 0.25)
  Top 0.254: IC1.7 23.91,80.2 R38.2 25.39,80.22 26.67,78.93 v28.57,78.93 | R3.1 v40.32,75.44 R6.1
  Bottom 0.254: v40.32,75.44 33.66,75.44 30.16,78.93 v28.57,78.93
N$4  (via drill 0.25)
  Top 0.203: U3.8 29.48,44.91 v27.94,43.37 | U4.14 43.52,40.85 v42.86,40.2
  Bottom 0.203: v27.94,43.37 39.69,43.37 v42.86,40.2
N$5  (via drill 0.25)
  Top 0.254: IC1.1 23.91,72.58 R37.2 26.02,72.57 26.67,73.22 v28.57,73.22 | R8.1 v53.66,75.44 R7.1
  Bottom 0.254: v53.66,75.44 49.21,75.44 48.26,74.49 31.11,74.49 29.84,73.22 v28.57,73.22
N$6  (via drill 0.25)
  Top 0.254: R46.2 14.19,72.58 IC1.14 v18.1,72.58 | R14.1 v66.99,75.44 R9.1
  Bottom 0.254: v66.99,75.44 63.18,79.25 30.8,79.25 29.84,80.2 20.95,80.2 19.05,78.3 19.05,73.53 v18.1,72.58
N$7  (via drill 0.25)
  Top 0.254: R47.2 14.19,80.2 IC1.8 17.78,80.2 v19.05,81.47 | R11.1 v80.33,75.44 R10.1
  Bottom 0.254: v80.33,75.44 75.88,79.88 31.43,79.88 29.84,81.47 v19.05,81.47
N$8
  Top 0.254: R3.2 40.02,73.2 39.37,73.85 39.37,77.03 35.09,81.31 J9.TIP
N$9
  Top 0.254: R8.2 53.35,73.2 52.7,73.85 52.7,77.03 48.42,81.31 J10.TIP
N$10
  Top 0.254: R14.2 66.69,73.2 66.04,73.85 66.04,77.03 61.76,81.31 J11.TIP
N$11
  Top 0.254: R10.2 80.03,73.2 79.38,73.85 79.38,77.03 75.09,81.31 J12.TIP
N$12
  Top 0.406: R18.1 P1.P$2
N$13  (via drill 0.25)
  Top 0.254: R21.1 v46.99,62.42 R66.1 | v36.2,63.69 32.38,59.88 IC4.1
  Bottom 0.254: v36.2,63.69 45.72,63.69 v46.99,62.42
N$14
  Top 0.203: U2.39 35.13,21.26 34.61,21.78 34.61,22.42 34.16,22.86 33.97,23.05 33.66,23.05 C20.2 33.53,23.05 30.48,23.05 29.84,23.69 Y1.2
N$15  (via drill 0.25)
  Top 0.254: R29.1 v60.33,62.42 R67.1 | v29.84,67.5 IC4.7
  Bottom 0.254: v60.33,62.42 48.9,62.42 47.62,61.15 46.35,61.15 44.77,62.74 31.11,62.74 30.48,63.37 30.48,66.87 v29.84,67.5
N$16
  Top 0.254: R66.2 LED5.A
N$17
  Top 0.203: U2.6 49.19,19.26 49.53,18.92 49.53,17.34 50.48,16.38 50.48,5.91 50.29,5.71 R48.1
N$18
  Top 0.203: U2.7 49.65,19.76 50.16,19.24 50.16,17.34 51.12,16.38 51.12,5.91 51.31,5.71 R48.2
N$21
  Top 0.254: R15.2 65.42,69.55 J15.TIP 68.74,67.98 72.39,64.33 72.39,61.15 73.04,60.5 R17.2
N$22
  Top 0.254: R23.2 78.75,69.55 J16.TIP 82.08,67.98 85.72,64.33 85.72,61.15 86.38,60.5 R51.2
N$23  (via drill 0.25)
  Top 0.254: R17.1 v73.66,62.42 R52.1 | v24.13,67.5 IC4.8
  Bottom 0.254: v73.66,62.42 72.39,61.15 48.9,61.15 48.26,60.52 45.72,60.52 44.13,62.1 29.21,62.1 28.26,63.06 28.26,64.64 25.4,67.5 v24.13,67.5
N$24
  Top 0.254: R67.2 LED6.A
N$28  (via drill 0.25)
  Top 0.203: R51.1 87.42,61.68 88.27,60.83 88.27,58.29 85.72,55.75 v75.56,55.75
  Top 0.254: R51.1 R53.1 | IC4.14 25.4,59.88 26.67,58.61 v31.11,58.61
  Bottom 0.254: v75.56,55.75 33.97,55.75 v31.11,58.61
N$29
  Top 0.254: LED7.A R52.2
N$30
  Top 0.254: R53.2 LED8.A
N$32
  Top 0.254: R19.2 38.75,69.55 J13.TIP 42.07,67.98 45.72,64.33 45.72,61.15 46.37,60.5 R21.2
N$33
  Top 0.254: R24.1 60.48,108.14 J17.TIP
N$34
  Top 0.254: R25.2 52.09,69.55 J14.TIP 55.41,67.98 59.05,64.33 59.05,61.15 59.7,60.5 R29.2
N$35
  Top 0.254: R27.1 13.81,94.81 J2.TIP
N$36
  Top 0.254: R30.1 20.48,108.14 J3.TIP
N$37
  Top 0.254: R34.1 27.15,94.81 J4.TIP
N$38
  Top 0.254: R32.1 7.14,108.14 J1.TIP
N$39
  Top 0.254: R36.1 33.81,108.14 J5.TIP
N$40
  Top 0.254: R56.1 40.48,94.81 J6.TIP
N$43
  Top 0.254: R58.1 47.15,108.14 J7.TIP
N$44
  Top 0.254: R60.1 53.82,94.81 J8.TIP
N$67
  Top 0.254: R6.2 LED1.A
N$68
  Top 0.254: R7.2 LED2.A
N$70
  Top 0.254: LED3.A R9.2
N$71
  Top 0.254: R11.2 LED4.A
N$109
  Top 0.203: U2.40 35.17,20.76 34.61,20.19 34.61,18.61 34.16,18.16 33.97,17.97 33.66,17.97 C19.2 33.53,17.97 30.16,17.97 29.97,17.84 29.84,17.97 Y1.1
NMI  (via drill 0.25)
  Top 0.203: POP.2 28.8,5.63 R4.1 C31.1 30.48,5.91 33.02,8.45 v33.02,12.89 | U2.33 35.78,24.26 v35.24,24.8
  Top 0.406: POP.1 POP.2
  Bottom 0.203: v33.02,12.89 34.61,14.48 34.61,16.38 35.24,17.02 v35.24,24.8
OLED-DC  (via drill 0.25)
  Top 0.203: U2.26 41.8,25.07 43.34,23.53 45.56,23.53 48.26,26.23 49.85,26.23 50.8,27.18 50.8,43.69 v56.83,49.72
  Bottom 0.203: U$1.4 60.94,53.83 v56.83,49.72
OLED-RES  (via drill 0.25)
  Top 0.203: U2.25 42.3,25.21 43.5,24 45.4,24 48.26,26.86 49.53,26.86 50.16,27.5 50.16,31.94 48.26,33.85 v46.35,33.85 | v25.4,48.77 25.4,48.75 U$1.16
  Bottom 0.203: v46.35,33.85 45.72,34.48 34.29,34.48 25.4,43.37 v25.4,48.77
RESET  (via drill 0.25)
  Top 0.203: U2.63 45.8,13.77 46.04,13.53 v46.04,13.21 | v21.91,16.7 12.51,16.7 R40.1
  Top 0.254: R40.1 C41.1 9.4,16.83 v8.89,17.34
  Bottom 0.203: v46.04,13.21 46.04,10.67 42.55,7.18 30.16,7.18 26.99,10.35 26.99,11.62 v21.91,16.7
  Bottom 0.406: v8.89,17.34 7.31,17.34 SW40.2
RG1
  Top 0.254: IC1.6 23.91,78.93 R38.1 24.11,78.9 R12.2
RG2
  Top 0.254: IC1.2 23.91,73.85 R37.1 24.11,73.88 R13.2
RG3
  Top 0.254: R22.2 13.98,73.88 R46.1 13.98,73.85 IC1.13
RG4
  Top 0.254: IC1.9 14.19,78.93 R47.1 13.97,77.68 R28.2
RG5
  Top 0.254: IC4.2 30.48,61.15 | 30.48,61.15 32.38,61.15 33.66,62.42 33.66,64.64 36.2,67.18 36.2,68.99 R19.1 | R31.2 30.46,61.17 30.48,61.15
RG6  (via drill 0.25)
  Top 0.254: v49.85,70.04 R25.1 | v33.34,67.82 31.75,66.23 30.48,66.23 | 30.48,66.23 IC4.6 | R33.2 30.46,66.22 30.48,66.23
  Bottom 0.254: v49.85,70.04 46.35,66.55 34.61,66.55 v33.34,67.82
RG7  (via drill 0.25)
  Top 0.254: v63.18,70.04 R15.1 | v31.43,68.45 26.35,68.45 24.13,66.23 IC4.9 20.95,66.23 20.32,65.6 20.32,64.98 R35.2
  Bottom 0.254: v63.18,70.04 59.05,65.91 33.97,65.91 v31.43,68.45
RG8  (via drill 0.25)
  Top 0.254: v76.52,70.04 R23.1 | IC4.13 v20.32,61.15 20.32,62.41 R39.2
  Bottom 0.254: v76.52,70.04 71.75,65.28 33.34,65.28 29.84,68.77 24.13,68.77 20.32,64.96 v20.32,61.15
RX  (via drill 0.25)
  Top 0.203: U2.59 43.8,17.32 v44.13,17.65
  Bottom 0.203: J40.4 v11.75,26.86 13.34,26.86 29.84,10.35 29.84,9.72 31.11,8.45 41.27,8.45 43.34,10.51 43.34,13.68 44.13,14.48 v44.13,17.65
SCK  (via drill 0.25)
  Top 0.203: U2.35 35.67,23.26 33.34,25.59 33.34,33.85 v37.47,37.97 | U4.12 42.22,41.78 40.32,39.88 v39.05,39.88 | U3.12 31.43,40.52 v32.07,39.88 | U7.1 72.02,49.46 69.22,52.26 54.91,52.26 U$1.7
  Bottom 0.203: 37.47,39.88 v39.05,39.88 40.64,38.29 46.35,38.29 53.34,45.28 U$1.7 | 37.47,39.88 v32.07,39.88 | v37.47,37.97 37.47,39.88
SCL  (via drill 0.25)
  Top 0.203: U2.28 40.8,24.16 40.64,24 40.64,20.51 39.37,19.24 39.37,18.61 v38.42,17.65 | R16.1 v17.14,28.77
  Bottom 0.203: v38.42,17.65 37.15,16.38 37.15,14.8 33.66,11.3 29.84,11.3 17.14,24 v17.14,28.77 17.14,33.21 13.34,37.02 2.54,37.02 1.91,37.66 1.91,39.56
  Bottom 0.254: 1.91,39.56 JP2.3 JP2.4 JP1.3 JP1.4
SDA  (via drill 0.25)
  Top 0.203: U2.29 40.3,24.61 40.01,24.32 40.01,20.51 v38.42,18.92 | R5.1 v18.41,26.86
  Bottom 0.203: v38.42,18.92 36.51,17.02 36.51,15.11 33.34,11.94 30.16,11.94 18.41,23.69 v18.41,26.86 18.41,33.21 14.61,37.02
  Bottom 0.254: 14.61,37.02 14.61,37.66 JP1.2 JP1.1 JP2.2 JP2.1
TX  (via drill 0.25)
  Top 0.203: U2.47 34.85,17.26 33.02,15.43 33.02,14.16 31.11,12.26 28.57,12.26 16.51,24.32 v11.75,24.32
  Bottom 0.203: J40.5 v11.75,24.32
USB-OC  (via drill 0.25, 0.5)
  Top 0.203: U2.60 44.3,16.55 45.09,17.34 46.04,17.34 48.26,15.11 v48.26,14.48
  Top 0.254: U1.5 17.14,14.8 v17.78,14.16 | R2.1 24.13,12.26 v25.72,10.67
  Bottom 0.203: v48.26,14.48 48.26,11.94 43.18,6.54 29.84,6.54 v25.72,10.67
  Bottom 0.254: v25.72,10.67 22.23,14.16 v17.78,14.16
USB-VBOF  (via drill 0.25)
  Top 0.203: U2.62 45.3,15.96 v45.72,16.38 | R1.1 24.45,14.16 v28.26,10.35
  Top 0.254: U1.4 21.27,14.8 21.91,15.43 22.99,15.43 R1.1
  Bottom 0.203: v45.72,16.38 45.72,14.16 45.09,13.53 45.09,10.99 41.91,7.81 30.8,7.81 v28.26,10.35
VBUS  (via drill 0.25, 0.38, 0.5)
  Top 0.203: U2.52 40.3,16.36 v40.64,16.7 | v31.43,9.4 25.08,9.4 v24.13,10.35
  Top 0.254: U1.6 17.14,13.53 v17.78,12.89
  Top 0.406: 12.83,10.99 C5.+ 12.7,9.08 12.06,8.45 C7.2
  Top 0.61: U1.6 U1.7 U1.8 12.83,10.99 | USB.1 5.39,7.49 8.89,10.99 C5.+
  Bottom 0.203: v40.64,16.7 41.27,16.07 41.27,12.89 37.78,9.4 v31.43,9.4 | v24.13,10.35 21.59,12.89 v17.78,12.89
VDDIN  (via drill 0.25)
  Top 0.203: C12.2 v44.45,28.13 44.3,27.98 U2.21 | C51.2 C12.2 | C50.2 C12.2 | R42.1 v53.34,31.94
  PWR 0.406: v53.34,31.94 50.16,28.77 45.09,28.77 v44.45,28.13
VDDIO  (via drill 0.25)
  Top 0.203: 36.26,16.76 v35.56,16.07 36.2,15.43 C17.2 C18.2 | C10.2 C49.2 | C47.2 C10.2 | U2.32 38.8,27.44 v38.1,28.13 C16.2 C56.2 | R41.1 v51.75,31.94 | U2.64 46.3,14.22 v47.31,13.21 C10.2
  Top 0.254: U2.48 36.26,16.76
  PWR 0.406: v51.75,31.94 49.85,30.04 40.01,30.04 v38.1,28.13
  pour PWR: 38.1,28.13 35.56,25.59 35.56,12.26 37.47,10.35 44.45,10.35 46.99,12.89 46.99,13.53 46.67,13.84 45.72,13.84 44.13,12.26 40.01,12.26 39.37,12.89 39.37,28.13
VDDOUT  (via drill 0.25)
  Top 0.203: U2.56 42.3,13.46 v42.55,13.21 C14.2 C52.2 | U2.8 49.6,20.26 v49.85,20.51 50.48,21.15 C8.2 C45.2 C46.2 | C55.2 C54.2 | C15.2 C54.2 | U2.53 40.8,13.68 v40.32,13.21 40.32,13.02 39.37,12.06 C54.2 | 39.37,11.62 C54.2 | C48.2 C11.2 47.62,29.08 46.67,28.13 45.72,28.13 44.8,27.21 U2.20 44.8,25.14 v44.45,24.8 43.8,25.45 U2.22 43.8,27.52 43.18,28.13 42.42,28.13 41.27,29.27 C13.2 C53.2
  Top 0.406: C9.2 C8.2
  pour PWR: 40.32,12.89 40.01,13.21 40.01,28.13 46.99,28.13 50.16,24.96 50.16,19.24 43.81,12.89
VREF
  Top 0.203: U3.1 34.02,49.14 35.88,50.99 65.41,50.99 70.84,45.56 U7.7

### Text on the board
Top: slotless
Bottom: monome.org / teletype180824
tPlace: gnd | scl | sda | 12864UCY3 - OPEN / 12864WDY3 - CLOSE
bPlace: gnd | scl | sda | gnd | rx | tx
bNames: -12v
bDocu: mosi | sck | miso | 12v | 3v3 | -12v | 5v | GND
_tPlace: PARAM
_bPlace: J40